# Altium project TAUV-Interfacer.PrjPCB (part 1 of 2)
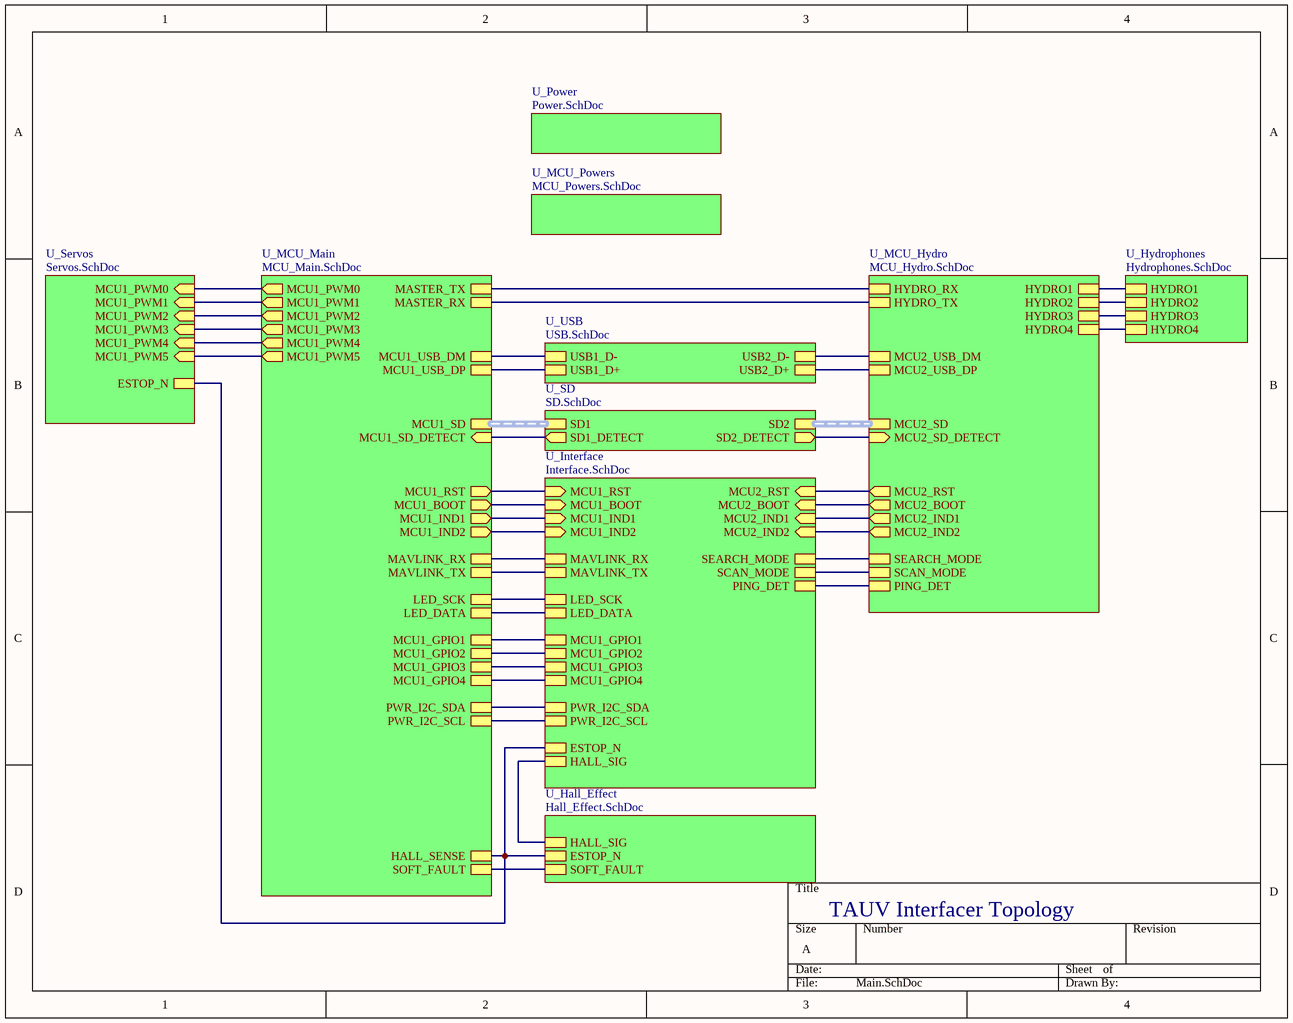
[diagram p0: Main.SchDoc]
12 sheets, 218 parts. Net scope: hierarchical (ports join the sheet entries above them; power ports are global).
Board file: TAUV-Interfacer.PcbDoc
Sheets:
  Main.SchDoc
    U_Hydrophones = Hydrophones.SchDoc
    U_MCU_Hydro = MCU_Hydro.SchDoc
    U_MCU_Main = MCU_Main.SchDoc
    U_SD = SD.SchDoc
    U_USB = USB.SchDoc
    U_MCU_Powers = MCU_Powers.SchDoc
    U_Power = Power.SchDoc
    U_Servos = Servos.SchDoc
    U_Interface = Interface.SchDoc
    U_Hall_Effect = Hall_Effect.SchDoc
  Hydrophone.SchDoc

## Sheet Main.SchDoc
size A; SheetNumber: 1

### Sub-sheets
U_Hall_Effect = Hall_Effect.SchDoc: ESTOP_N, HALL_SIG, SOFT_FAULT
U_Hydrophones = Hydrophones.SchDoc: HYDRO1, HYDRO2, HYDRO3, HYDRO4
U_Interface = Interface.SchDoc: MCU1_BOOT (in), MAVLINK_RX, MAVLINK_TX, LED_SCK, LED_DATA, MCU1_GPIO1, MCU1_GPIO2, MCU1_GPIO3, MCU1_GPIO4, PWR_I2C_SDA, PWR_I2C_SCL, ESTOP_N, HALL_SIG, MCU1_RST (in), MCU1_IND1 (in), MCU1_IND2 (in), MCU2_RST (in), MCU2_BOOT (in), MCU2_IND1 (in), MCU2_IND2 (in), SEARCH_MODE, SCAN_MODE, PING_DET
U_MCU_Hydro = MCU_Hydro.SchDoc: MCU2_BOOT (out), MCU2_USB_DM, MCU2_USB_DP, MCU2_SD (harness SDIO), HYDRO_TX, HYDRO_RX, HYDRO1, HYDRO2, HYDRO3, HYDRO4, MCU2_SD_DETECT (in), MCU2_IND2 (out), SEARCH_MODE, MCU2_IND1 (out), MCU2_RST (out), SCAN_MODE, PING_DET
U_MCU_Main = MCU_Main.SchDoc: MCU1_BOOT (out), MCU1_USB_DM, MCU1_USB_DP, MCU1_SD (harness SDIO), LED_SCK, LED_DATA, MAVLINK_TX, MAVLINK_RX, MASTER_TX, MASTER_RX, MCU1_SD_DETECT (in), MCU1_PWM1 (out), MCU1_PWM2 (out), MCU1_PWM3 (out), MCU1_PWM4 (out), MCU1_PWM5 (out), MCU1_GPIO1, MCU1_GPIO2, MCU1_IND2 (out), MCU1_PWM0 (out), MCU1_IND1 (out), MCU1_GPIO3, MCU1_GPIO4, PWR_I2C_SDA, PWR_I2C_SCL, HALL_SENSE, MCU1_RST (out), SOFT_FAULT
U_MCU_Powers = MCU_Powers.SchDoc: no entries
U_Power = Power.SchDoc: no entries
U_SD = SD.SchDoc: SD1 (harness SDIO), SD1_DETECT (out), SD2 (harness SDIO), SD2_DETECT (out)
U_Servos = Servos.SchDoc: MCU1_PWM1 (in), MCU1_PWM2 (in), MCU1_PWM3 (in), MCU1_PWM4 (in), MCU1_PWM5 (in), MCU1_PWM0 (in), ESTOP_N
U_USB = USB.SchDoc: USB1_D-, USB1_D+, USB2_D-, USB2_D+

### Nets
HALL_SENSE: sheet U_MCU_Main/HALL_SENSE, sheet U_Servos/ESTOP_N, sheet U_Interface/ESTOP_N, sheet U_Hall_Effect/ESTOP_N
IND_PING: sheet U_MCU_Hydro/PING_DET, sheet U_Interface/PING_DET
IND_SCAN: sheet U_MCU_Hydro/SCAN_MODE, sheet U_Interface/SCAN_MODE
IND_SEARCH: sheet U_MCU_Hydro/SEARCH_MODE, sheet U_Interface/SEARCH_MODE
MCU1_BOOT: sheet U_MCU_Main/MCU1_BOOT, sheet U_Interface/MCU1_BOOT
MCU1_GPIO1: sheet U_MCU_Main/MCU1_GPIO1, sheet U_Interface/MCU1_GPIO1
MCU1_GPIO2: sheet U_MCU_Main/MCU1_GPIO2, sheet U_Interface/MCU1_GPIO2
MCU1_GPIO3: sheet U_MCU_Main/MCU1_GPIO3, sheet U_Interface/MCU1_GPIO3
MCU1_GPIO4: sheet U_MCU_Main/MCU1_GPIO4, sheet U_Interface/MCU1_GPIO4
MCU1_I2C_SCL: sheet U_MCU_Main/PWR_I2C_SCL, sheet U_Interface/PWR_I2C_SCL
MCU1_I2C_SDA: sheet U_MCU_Main/PWR_I2C_SDA, sheet U_Interface/PWR_I2C_SDA
MCU1_IND1: sheet U_MCU_Main/MCU1_IND1, sheet U_Interface/MCU1_IND1
MCU1_IND2: sheet U_MCU_Main/MCU1_IND2, sheet U_Interface/MCU1_IND2
MCU1_PWM0: sheet U_MCU_Main/MCU1_PWM0, sheet U_Servos/MCU1_PWM0
MCU1_PWM1: sheet U_MCU_Main/MCU1_PWM1, sheet U_Servos/MCU1_PWM1
MCU1_PWM2: sheet U_MCU_Main/MCU1_PWM2, sheet U_Servos/MCU1_PWM2
MCU1_PWM3: sheet U_MCU_Main/MCU1_PWM3, sheet U_Servos/MCU1_PWM3
MCU1_PWM4: sheet U_MCU_Main/MCU1_PWM4, sheet U_Servos/MCU1_PWM4
MCU1_PWM5: sheet U_MCU_Main/MCU1_PWM5, sheet U_Servos/MCU1_PWM5
MCU1_SD_DETECT: sheet U_MCU_Main/MCU1_SD_DETECT, sheet U_SD/SD1_DETECT
MCU1_SOFT_FAULT: sheet U_MCU_Main/SOFT_FAULT, sheet U_Hall_Effect/SOFT_FAULT
MCU1_SPI1_MOSI: sheet U_MCU_Main/LED_DATA, sheet U_Interface/LED_DATA
MCU1_SPI1_SCK: sheet U_MCU_Main/LED_SCK, sheet U_Interface/LED_SCK
MCU1_UART4_RX: sheet U_MCU_Main/MAVLINK_RX, sheet U_Interface/MAVLINK_RX
MCU1_UART4_TX: sheet U_MCU_Main/MAVLINK_TX, sheet U_Interface/MAVLINK_TX
MCU1_USB_DM: sheet U_MCU_Main/MCU1_USB_DM, sheet U_USB/USB1_D-
MCU1_USB_DP: sheet U_MCU_Main/MCU1_USB_DP, sheet U_USB/USB1_D+
MCU2_ADC1_IN10: sheet U_Hydrophones/HYDRO1, sheet U_MCU_Hydro/HYDRO1
MCU2_ADC1_IN11: sheet U_Hydrophones/HYDRO2, sheet U_MCU_Hydro/HYDRO2
MCU2_ADC1_IN12: sheet U_Hydrophones/HYDRO3, sheet U_MCU_Hydro/HYDRO3
MCU2_ADC1_IN13: sheet U_Hydrophones/HYDRO4, sheet U_MCU_Hydro/HYDRO4
MCU2_BOOT: sheet U_MCU_Hydro/MCU2_BOOT, sheet U_Interface/MCU2_BOOT
MCU2_IND1: sheet U_MCU_Hydro/MCU2_IND1, sheet U_Interface/MCU2_IND1
MCU2_IND2: sheet U_MCU_Hydro/MCU2_IND2, sheet U_Interface/MCU2_IND2
MCU2_SD_DETECT: sheet U_MCU_Hydro/MCU2_SD_DETECT, sheet U_SD/SD2_DETECT
MCU2_USART2_RX: sheet U_MCU_Hydro/HYDRO_RX, sheet U_MCU_Main/MASTER_TX
MCU2_USART2_TX: sheet U_MCU_Hydro/HYDRO_TX, sheet U_MCU_Main/MASTER_RX
MCU2_USB_DM: sheet U_MCU_Hydro/MCU2_USB_DM, sheet U_USB/USB2_D-
MCU2_USB_DP: sheet U_MCU_Hydro/MCU2_USB_DP, sheet U_USB/USB2_D+
NetP2_3: sheet U_MCU_Main/MCU1_RST, sheet U_Interface/MCU1_RST
NetP2_9: sheet U_MCU_Hydro/MCU2_RST, sheet U_Interface/MCU2_RST
NetP3_3: sheet U_Interface/HALL_SIG, sheet U_Hall_Effect/HALL_SIG

### Buses and harness runs
harness sheet U_MCU_Hydro/MCU2_SD = sheet U_SD/SD2
harness sheet U_MCU_Main/MCU1_SD = sheet U_SD/SD1

### Notes on the sheet
- TAUV Interfacer Topology

## Sheet Hydrophones.SchDoc
size 279 x 203 mm; SheetNumber: 7
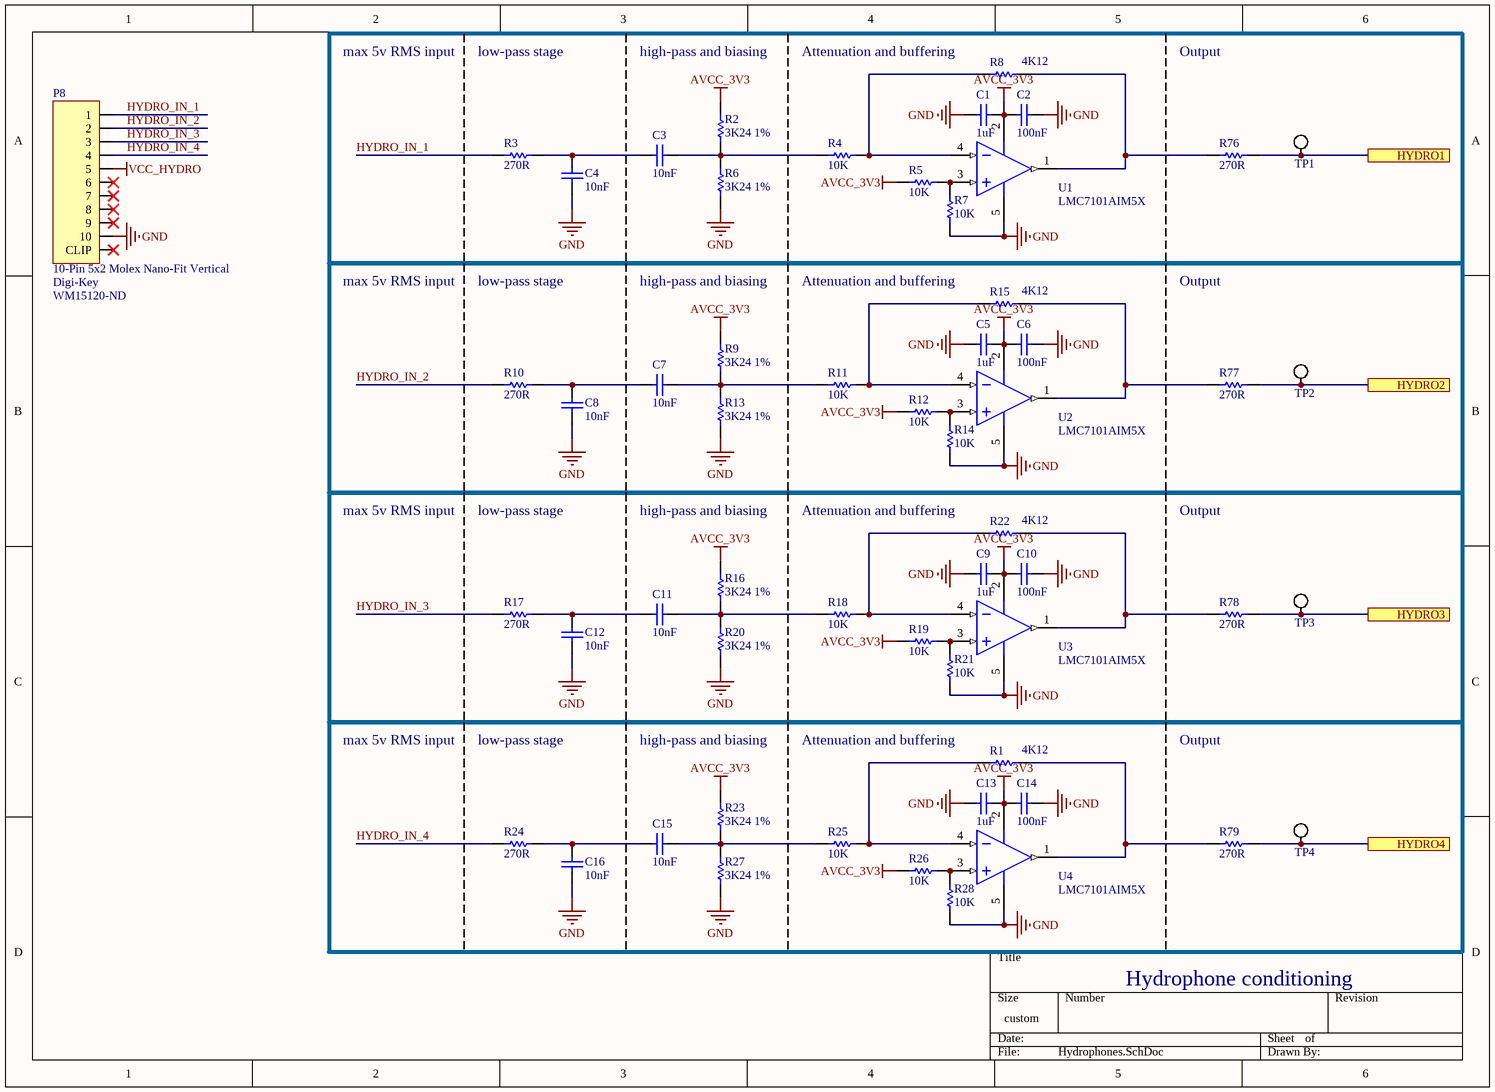
[diagram p1: Hydrophones.SchDoc]

### Parts
(Parts that share a designator on the sheet are numbered #1, #2 ... from top to bottom, then left to right.)
C1#1  1uF  [CAPC0603(1608)100_N]
C2#1  100nF  [CAPC0603(1608)100_N]
C3#1  10nF  [CAPC0603(1608)100_N]
C4#1  10nF  [CAPC0603(1608)100_N]
C5#1  1uF  [CAPC0603(1608)100_N]
C6#1  100nF  [CAPC0603(1608)100_N]
C7#1  10nF  [CAPC0603(1608)100_N]
C8#1  10nF  [CAPC0603(1608)100_N]
C9#1  1uF  [CAPC0603(1608)100_N]
C10  100nF  [CAPC0603(1608)100_N]
C11  10nF  [CAPC0603(1608)100_N]
C12  10nF  [CAPC0603(1608)100_N]
C13  1uF  [CAPC0603(1608)100_N]
C14  100nF  [CAPC0603(1608)100_N]
C15  10nF  [CAPC0603(1608)100_N]
C16  10nF  [CAPC0603(1608)100_N]
P8  10-Pin 5x2 Molex Nano-Fit Vertical  Supplier 1: Digi-Key  Supplier Part Number 1: WM15120-ND  [MOLEX NANO-FIT 2x5 - Vertical]
R1#1  4K12  [RESC0603(1608)_M]
R2#1  3K24 1%  [RESC0603(1608)_N]
R3#1  270R  [RESC0603(1608)_N]
R4#1  10K  [RESC0603(1608)_N]
R5#1  10K  [RESC0603(1608)_N]
R6#1  3K24 1%  [RESC0603(1608)_N]
R7#1  10K  [RESC0603(1608)_N]
R8#1  4K12  [RESC0603(1608)_M]
R9#1  3K24 1%  [RESC0603(1608)_N]
R10#1  270R  [RESC0603(1608)_N]
R11#1  10K  [RESC0603(1608)_N]
R12#1  10K  [RESC0603(1608)_N]
R13#1  3K24 1%  [RESC0603(1608)_N]
R14#1  10K  [RESC0603(1608)_N]
R15#1  4K12  [RESC0603(1608)_M]
R16  3K24 1%  [RESC0603(1608)_N]
R17  270R  [RESC0603(1608)_N]
R18  10K  [RESC0603(1608)_N]
R19  10K  [RESC0603(1608)_N]
R20  3K24 1%  [RESC0603(1608)_N]
R21  10K  [RESC0603(1608)_N]
R22  4K12  [RESC0603(1608)_M]
R23  3K24 1%  [RESC0603(1608)_N]
R24  270R  [RESC0603(1608)_N]
R25  10K  [RESC0603(1608)_N]
R26  10K  [RESC0603(1608)_N]
R27  3K24 1%  [RESC0603(1608)_N]
R28  10K  [RESC0603(1608)_N]
R76  270R  [RESC0603(1608)_N]
R77  270R  [RESC0603(1608)_N]
R78  270R  [RESC0603(1608)_N]
R79  270R  [RESC0603(1608)_N]
TP1#1  Test Point Loop  [Test Point Loop - Black]  (value not drawn)
TP2  Test Point Loop  [Test Point Loop - Black]  (value not drawn)
TP3  Test Point Loop  [Test Point Loop - Black]  (value not drawn)
TP4  Test Point Loop  [Test Point Loop - Black]  (value not drawn)
U1#1  LMC7101AIM5X  [DBV0005A_N]
U2#1  LMC7101AIM5X  [DBV0005A_N]
U3#1  LMC7101AIM5X  [DBV0005A_N]
U4  LMC7101AIM5X  [DBV0005A_N]

### Ports
HYDRO1, HYDRO2, HYDRO3, HYDRO4

### Nets
AVCC_3V3: C1#1.1 C2#1.2 C5#1.1 C6#1.2 C9#1.1 C10.2 C13.1 C14.2 R2#1.2 R5#1.1 R9#1.2 R12#1.1 R16.2 R19.1 R23.2 R26.1 U1#1.2(V+) U2#1.2(V+) U3#1.2(V+) U4.2(V+)
GND: C1#1.2 C2#1.1 C4#1.1 C5#1.2 C6#1.1 C8#1.1 C9#1.2 C10.1 C12.1 C13.2 C14.1 C16.1 P8.10 R6#1.1 R7#1.1 R13#1.1 R14#1.1 R20.1 R21.1 R27.1 R28.1 U1#1.5(V-) U2#1.5(V-) U3#1.5(V-) U4.5(V-)
VCC_HYDRO: P8.5
HYDRO_IN_1: P8.1 R3#1.1
HYDRO_IN_2: P8.2 R10#1.1
HYDRO_IN_3: P8.3 R17.1
HYDRO_IN_4: P8.4 R24.1
MCU2_ADC1_IN10: R76.2 TP1#1.1 ; port HYDRO1
MCU2_ADC1_IN11: R77.2 TP2.1 ; port HYDRO2
MCU2_ADC1_IN12: R78.2 TP3.1 ; port HYDRO3
MCU2_ADC1_IN13: R79.2 TP4.1 ; port HYDRO4
NetC3#1_1: C3#1.1 C4#1.2 R3#1.2
NetC3#1_2: C3#1.2 R2#1.1 R4#1.1 R6#1.2
NetC7#1_1: C7#1.1 C8#1.2 R10#1.2
NetC7#1_2: C7#1.2 R9#1.1 R11#1.1 R13#1.2
NetC11_1: C11.1 C12.2 R17.2
NetC11_2: C11.2 R16.1 R18.1 R20.2
NetC15_1: C15.1 C16.2 R24.2
NetC15_2: C15.2 R23.1 R25.1 R27.2
NetR1#1_1: R1#1.1 R25.2 U4.4(IN-)
NetR1#1_2: R1#1.2 R79.1 U4.1(OUT)
NetR4#1_2: R4#1.2 R8#1.1 U1#1.4(IN-)
NetR5#1_2: R5#1.2 R7#1.2 U1#1.3(IN+)
NetR8#1_2: R8#1.2 R76.1 U1#1.1(OUT)
NetR11#1_2: R11#1.2 R15#1.1 U2#1.4(IN-)
NetR12#1_2: R12#1.2 R14#1.2 U2#1.3(IN+)
NetR15#1_2: R15#1.2 R77.1 U2#1.1(OUT)
NetR18_2: R18.2 R22.1 U3#1.4(IN-)
NetR19_2: R19.2 R21.2 U3#1.3(IN+)
NetR22_2: R22.2 R78.1 U3#1.1(OUT)
NetR26_2: R26.2 R28.2 U4.3(IN+)

Not connected (* = marked no-connect by the designer): P8 6* 7* 8* 9* 11(CLIP)*

### Notes on the sheet
- max 5v RMS input
- low-pass stage
- high-pass and biasing
- (near R8#1) Attenuation and buffering
- Output
- (near R15#1) Attenuation and buffering
- (near R22) Attenuation and buffering
- (near R1#1) Attenuation and buffering
- Hydrophone conditioning

### Library data of the parts
C1#1 C5#1 C9#1 C13 = CMP-1035-02733-1: CAP 1uF 10V ±10% 0603 (1608 Metric) Thickness 1mm SMD; Tolerance: Â±10%; Case-EIA: 0603; Case-Metric: 1608; Rated Voltage: 10 V; Max Thickness: 1 mm; Value: 1uF; Technology: SMT
C2#1 C6#1 C10 C14 = CMP-1035-02580-1: CAP 100nF 10V ±10% 0603 (1608 Metric) Thickness 1mm SMD; Tolerance: Â±10%; Case-EIA: 0603; Case-Metric: 1608; Max Thickness: 1 mm; Value: 100nF; Rated Voltage: 10 V; Technology: SMT
C3#1 C4#1 C7#1 C8#1 C11 C12 C15 C16 = CMP-1035-02314-1: CAP 10nF 25V ±1% 0603 (1608 Metric) Thickness 1mm SMD; Case-EIA: 0603; Tolerance: Â±1%; Case-Metric: 1608; Technology: SMT; Value: 10nF; Rated Voltage: 25 V; Max Thickness: 1 mm
P8 = 10-Pin 2-Row Nano-Fit_Vertical: NanoFit VT Hdr TH DR 10Ckt; Part Number: 105314-1216; Supplier: Digi-Key; Manufacturer: Molex; Supplier Part Number: WM15165-ND; ComponentLink1Description: Digikey Link; ComponentLink1URL: https://www.digikey.com/product-detail/en/molex-llc/1053121310/WM15120-ND/6164209
R1#1 R8#1 R15#1 R22 = CMP-1012-00579-1: 4K12 0.1W 1% 0603 (1608 Metric)  SMD; Case-EIA: 0603; Value: 4120.00 Ohm; Case-Metric: 1608; Technology: SMT; Tolerance: 1 %; Power: 0.1 W
R2#1 R6#1 R9#1 R13#1 R16 R20 R23 R27 = CMP-1012-00566-1: 3K24 0.1W 1% 0603 (1608 Metric)  SMD; Value: 3240.00 Ohm; Case-Metric: 1608; Case-EIA: 0603; Tolerance: 1 %; Technology: SMT; Power: 0.1 W
R3#1 R10#1 R17 R24 R76-R79 = CMP-1012-00444-1: 270R 0.1W 1% 0603 (1608 Metric)  SMD; Value: 270.00 Ohm; Case-EIA: 0603; Case-Metric: 1608; Technology: SMT; Power: 0.1 W; Tolerance: 1 %
R4#1 R5#1 R7#1 R11#1 R12#1 R14#1 R18 R19 R21 R25 R26 R28 = CMP-1012-00623-1: 10K 0.1W 1% 0603 (1608 Metric)  SMD; Value: 10000.00 Ohm; Case-EIA: 0603; Case-Metric: 1608; Power: 0.1 W; Tolerance: 1 %; Technology: SMT
TP1#1 TP2-TP4 = Test Point Loop: Keyston Electronics 5001 Test Point Loop; Manufacturer P/N: 5001; Manufacturer: Keystone Electronics; Color: Black; Supplier 1: Digi-Key; Supplier Part Number 1: 36-5001-ND
U1#1 U2#1 U3#1 U4 = CMP-0055-01331-3: Tiny Low Power Operational Amplifier with Rail-to-Rail Input and Output, 5-pin SOT-23; Manufacturer: Texas Instruments; CompType: Amplifiers; PowerWise: N; PackageTopMarking: A00A*XTT; Package Reference: DBV0005A; ComponentLink1URL: http://www.ti.com/general/docs/lit/getliterature.tsp?genericPartNumber=LMC7101&fileType=pdf; ComponentLink1Description: Datasheet URL; RoHS: N; PackageDescription: Molded SOT-23, .115 x .063 x .040 in Body, 5 Lead, .0375 in Pitch; PinCount: 5

## Sheet MCU_Hydro.SchDoc
size A4; SheetNumber: 6
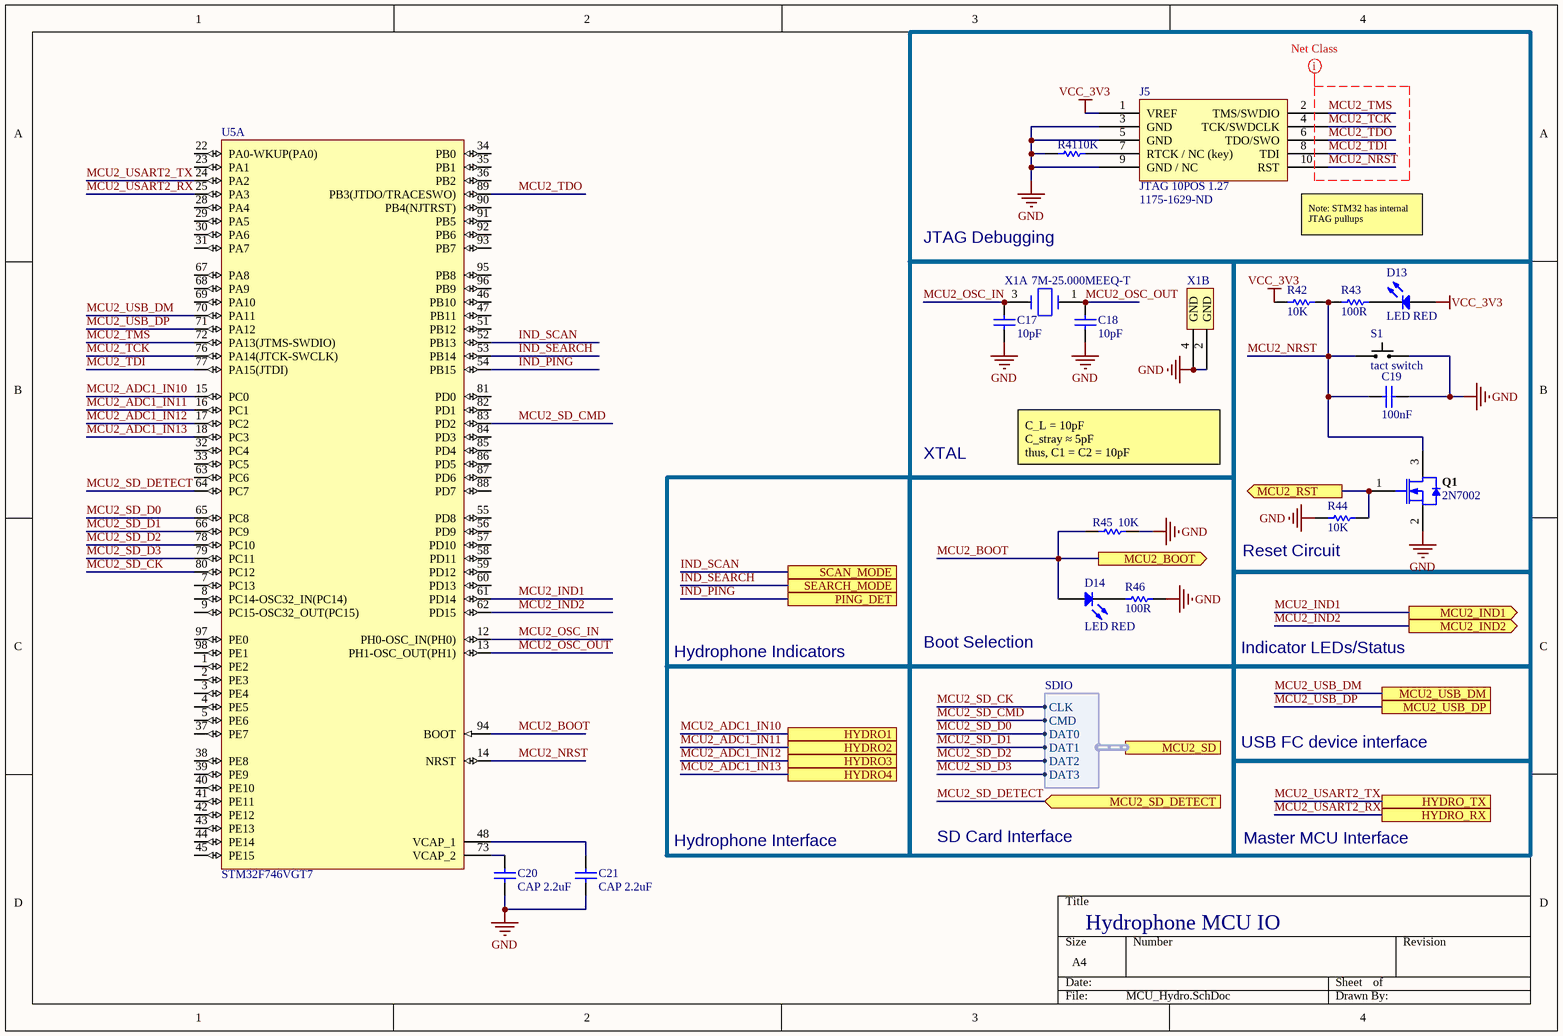
[diagram p2: MCU_Hydro.SchDoc]

### Parts
C17  10pF  [CAPC0603(1608)100_N]
C18  10pF  [CAPC0603(1608)100_N]
C19  100nF  [CAPC0603(1608)100_N]
C20  CAP 2.2uF  [CAPC0603(1608)100_N]
C21  CAP 2.2uF  [CAPC0603(1608)100_N]
D13  LED RED  [LED_0805]
D14  LED RED  [LED_0805]
J5  JTAG 10POS 1.27  Supplier Part Number 1: 1175-1629-ND  [5x2 JTAG SMD]
Q1  2N7002  [INF-PG-SOT23_M]
R41  10K  [RESC0603(1608)_N]
R42  10K  [RESC0603(1608)_N]
R43  100R  [RESC0603(1608)_N]
R44  10K  [RESC0603(1608)_N]
R45  10K  [RESC0603(1608)_N]
R46  100R  [RESC0603(1608)_N]
S1  tact switch  [EVP-AA202K]
U5  STM32F746VGT7  [STM-LQFP100_L]  (part A of 2)
X1  7M-25.000MEEQ-T  [OSCSC320X250X100N]  (parts A,B of 2)

### Blocks framed on the sheet
JTAG Debugging: J5 R41
Reset Circuit: C19 D13 Q1 R42-R44 S1

### Ports
HYDRO1, HYDRO2, HYDRO3, HYDRO4, HYDRO_RX, HYDRO_TX, MCU2_BOOT (out), MCU2_IND1 (out), MCU2_IND2 (out), MCU2_RST (out), MCU2_SD (harness SDIO), MCU2_SD_DETECT (in), MCU2_USB_DM, MCU2_USB_DP, PING_DET, SCAN_MODE, SEARCH_MODE

### Harnesses
SDIO: CLK, CMD, DAT0, DAT1, DAT2, DAT3

### Nets
GND: C17.1 C18.1 C19.1 C20.1 C21.1 J5.3(GND) J5.5(GND) J5.9(GND_/_NC) Q1.2(SOURCE) R41.1 R44.2 R45.2 R46.2 S1.2 X1.2(GND) X1.4(GND)
VCC_3V3: D13.2(A) J5.1(VREF) R42.2
IND_PING: U5.54(PB15) ; port PING_DET
IND_SCAN: U5.52(PB13) ; port SCAN_MODE
IND_SEARCH: U5.53(PB14) ; port SEARCH_MODE
MCU2_ADC1_IN10: U5.15(PC0) ; port HYDRO1
MCU2_ADC1_IN11: U5.16(PC1) ; port HYDRO2
MCU2_ADC1_IN12: U5.17(PC2) ; port HYDRO3
MCU2_ADC1_IN13: U5.18(PC3) ; port HYDRO4
MCU2_BOOT: D14.2(A) R45.1 U5.94(BOOT) ; port MCU2_BOOT
MCU2_IND1: U5.61(PD14) ; port MCU2_IND1
MCU2_IND2: U5.62(PD15) ; port MCU2_IND2
MCU2_NRST: C19.2 J5.10(RST) Q1.3(DRAIN) R42.1 R43.2 S1.1 U5.14(NRST)
MCU2_OSC_IN: C17.2 U5.12(PH0-OSC_IN(PH0)) X1.3
MCU2_OSC_OUT: C18.2 U5.13(PH1-OSC_OUT(PH1)) X1.1
MCU2_SD_CK: U5.80(PC12) ; port MCU2_SD.CLK
MCU2_SD_CMD: U5.83(PD2) ; port MCU2_SD.CMD
MCU2_SD_D0: U5.65(PC8) ; port MCU2_SD.DAT0
MCU2_SD_D1: U5.66(PC9) ; port MCU2_SD.DAT1
MCU2_SD_D2: U5.78(PC10) ; port MCU2_SD.DAT2
MCU2_SD_D3: U5.79(PC11) ; port MCU2_SD.DAT3
MCU2_SD_DETECT: U5.64(PC7) ; port MCU2_SD_DETECT
MCU2_TCK: J5.4(TCK/SWDCLK) U5.76(PA14(JTCK-SWCLK))
MCU2_TDI: J5.8(TDI) U5.77(PA15(JTDI))
MCU2_TDO: J5.6(TDO/SWO) U5.89(PB3(JTDO/TRACESWO))
MCU2_TMS: J5.2(TMS/SWDIO) U5.72(PA13(JTMS-SWDIO))
MCU2_USART2_RX: U5.25(PA3) ; port HYDRO_RX
MCU2_USART2_TX: U5.24(PA2) ; port HYDRO_TX
MCU2_USB_DM: U5.70(PA11) ; port MCU2_USB_DM
MCU2_USB_DP: U5.71(PA12) ; port MCU2_USB_DP
NetC20_2: C20.2 U5.73(VCAP_2)
NetC21_2: C21.2 U5.48(VCAP_1)
NetD13_1: D13.1(K) R43.1
NetD14_1: D14.1(K) R46.1
NetJ5_7: J5.7(RTCK_/_NC_(key)) R41.2
NetP2_9: Q1.1(GATE) R44.1 ; port MCU2_RST

Not connected (* = marked no-connect by the designer): U5 1(PE2) 2(PE3) 3(PE4) 4(PE5) 5(PE6) 7(PC13) 8(PC14-OSC32_IN(PC14)) 9(PC15-OSC32_OUT(PC15)) 22(PA0-WKUP(PA0)) 23(PA1) 28(PA4) 29(PA5) 30(PA6) 31(PA7) 32(PC4) 33(PC5) 34(PB0) 35(PB1) 36(PB2) 37(PE7) 38(PE8) 39(PE9) 40(PE10) 41(PE11) 42(PE12) 43(PE13) 44(PE14) 45(PE15) 46(PB10) 47(PB11) 51(PB12) 55(PD8) 56(PD9) 57(PD10) 58(PD11) 59(PD12) 60(PD13) 63(PC6) 67(PA8) 68(PA9) 69(PA10) 81(PD0) 82(PD1) 84(PD3) 85(PD4) 86(PD5) 87(PD6) 88(PD7) 90(PB4(NJTRST)) 91(PB5) 92(PB6) 93(PB7) 95(PB8) 96(PB9) 97(PE0) 98(PE1)

### Layout directives
net class JTAG: MCU2_NRST, MCU2_TCK, MCU2_TDI, MCU2_TDO, MCU2_TMS

### Notes on the sheet
- (near J5) Note: STM32 has internal JTAG pullups
- XTAL
- C_L = 10pF
  C_stray ≈ 5pF
  thus, C1 = C2 = 10pF
- Boot Selection
- Indicator LEDs/Status
- Hydrophone Indicators
- USB FC device interface
- Hydrophone Interface
- SD Card Interface
- Master MCU Interface
- Hydrophone MCU IO

### Library data of the parts
C17 C18 = CMP-1035-00549-1: CAP 10pF 25V ±1% 0603 (1608 Metric) Thickness 1mm SMD; Case-EIA: 0603; Case-Metric: 1608; Tolerance: Â±1%; Technology: SMT; Max Thickness: 1 mm; Value: 10pF; Rated Voltage: 25 V
C19 = CMP-1035-02580-1: as C2#1 on sheet Hydrophones; Max Thickness: 1 mm; Value: 100nF; Rated Voltage: 10 V; Technology: SMT
C20 C21 = CMP-1035-02758-1: CAP 2.2uF 10V ±10% 0603 (1608 Metric) Thickness 1mm SMD; Case-EIA: 0603; Case-Metric: 1608; Tolerance: Â±10%; Rated Voltage: 10 V; Value: 2.2uF; Max Thickness: 1 mm; Technology: SMT
D13 D14 = LED0: led; Manufacturer: Lite-On Inc.; Manufacturer Part Number: LTST-C171KRKT; Lens Color: Colorless; Lens Transparency: Clear; Millicandela Rating: 54mcd; Lens Style/Size: Rectangle with Flat Top, 1.40mm x 1.25mm; Voltage - Forward (Vf) (Typ): 2V; Current - Test: 20mA; Viewing Angle: 130°; Wavelength - Dominant: 631nm; Wavelength - Peak: 639nm; Supplier 1: Digi-Key; Supplier Part Number 1: 160-1427-1-ND; RoHS: RoHS Compliant; Category: Optoelectronics; Stock 1: 260544; Pricing 1: 1=0.31, 10=0.225, 25=0.1656, 100=0.1183, 250=0.0804, 500=0.07096, 1000=0.05558 (USD); Packaging: Cut Tape (CT); Part Status: Active; Color: Red; Mounting Type: Surface Mount; Features: -; Package / Case: 0805 (2012 Metric); Size / Dimension: 2.00mm L x 1.25mm W; Height (Max): 0.80mm; ComponentLink1URL: http://optoelectronics.liteon.com/upload/download/DS22-2000-109/LTST-C171KRKT.pdf; ComponentLink1Description: http://optoelectronics.liteon.com/upload/download/DS22-2000-109/LTST-C171KRKT.pdf
J5 = jtag 10pos mini: Supplier 1: Digi-Key
Q1 = CMP-1149-00026-1: N-Channel OptiMOS Small-Signal-Transistor, 60 V VDS, 0.3 A ID, -55 to 150 degC, PG-SOT23, Reel, Green; Manufacturer: Infineon; RDS (on) (max) (@4.5V): 4,000 mOhm; VDS (max): 60 V; IDpuls (max): 1.2Â A; QG: 0.4Â nC; RDS (on) (max): 3,000 mOhm; RthJA (max): 250 K/W; ID (max): 0.3Â A; VGS(th) (max): 2.5Â V; VGS(th) (min): 1.5Â V; Green: TRUE; Ptot (max): 0.5Â W; PackageDescription: 3-Pin Small Outline Transistor Package, 2.9 x 1.3 mm Body, 0.95 mm Pitch; Halogen-free: TRUE; ComponentLink2Description: Datasheet; ComponentLink1URL: http://www.infineon.com/; Packing: Reel; DatasheetVersion: Rev. 2.4; PartNumber: 2N7002; PackageReference: PG-SOT23; PackageVersion: Apr-08; ComponentLink3URL: http://www.infineon.com/dgdl/SOT23-Package_Overview.pdf?folderId=db3a30431936bc4b0119532290053c66&fileId=db3a30431936bc4b0119533468123c85; ComponentLink1Description: Manufacturer URL; Mounting Technology: Surface Mount; ComponentLink3Description: Package Specification; ComponentLink2URL: http://www.infineon.com/dgdl/2N7002_Rev2.4.pdf?folderId=db3a3043156fd573011622e10b5c1f67&fileId=db3a304319bc939a0119c2a9461e79e6
R41 R42 R44 R45 = CMP-1012-00098-1: 10K 0.1W 5% 0603 (1608 Metric)  SMD; Case-EIA: 0603; Value: 10000.00 Ohm; Case-Metric: 1608; Technology: SMT; Tolerance: 5 %; Power: 0.1 W
R43 R46 = CMP-1012-00050-1: 100R 0.1W 5% 0603 (1608 Metric)  SMD; Case-EIA: 0603; Value: 100.00 Ohm; Case-Metric: 1608; Tolerance: 5 %; Technology: SMT; Power: 0.1 W
S1 = EVP-AA Switch: EVP-AA Momentary Switch SPST-NO; Part Number: EVP-AA202K; Supplier 1: Digi-Key; Supplier Part Number 1: P13348SCT-ND; Datasheet: http://industrial.panasonic.com/lecs/www-data/pdf/ATK0000/ATK0000CE26.pdf
U5 = CMP-1572-00044-1: ARM Cortex-M4 32-bit MCU+FPU, 1024 KB Flash, 320 KB Internal RAM, 82 I/Os, 100-Pin LQFP, -40 to 105 degC, Tray; FLASH Size (Prog) (kB): 1024; Internal RAM Size (kB): 320; I/Os (High Current): 82; Core: ARM Cortex-M7; Operating Frequency(F) (Processor speed) (MHz): 216; D/A Converter: 2; Supply Voltage(Vcc) min (V): 1.7; ComponentLink2Description: Datasheet; Package Reference: LQFP100; ComponentLink1URL: http://www.st.com/; Mounting Technology: Surface Mount; DatasheetVersion: Rev. 2; Package Description: 100-Pin Low Profile Quad Flat Package, Body 14 x 14 mm, Pitch 0.5 mm; ComponentLink1Description: Manufacturer URL; ComponentLink2URL: http://www.st.com/st-web-ui/static/active/en/resource/technical/document/datasheet/DM00166116.pdf; Packing: Tray
X1 = 7M-25.000MEEQ-T: CRYSTAL 25.0000MHZ 10PF SMD; Manufacturer 1: TXC; Frequency: 25MHz; Frequency Tolerance: 10ppm; ESR (Equivalent Series Resistance): 60R; Supplier 1: Digi-Key; Supplier Part Number 1: 887-1326-1-ND; Manufacturer Part Number 1: 7M-25.000MEEQ-T; Stock 1: 17097; Pricing 1: 1=1.27, 10=1.209, 50=1.1812, 100=1.0125, 500=0.9844, 1000=0.8297 (USD); Mount: Surface Mount; Case/Package: SMD/SMT; Number of Pins: 4; Min Operating Temperature: -20°C; Max Operating Temperature: 70°C; Load Capacitance: 10pF; Packaging: Tape and Reel; Package Quantity: 3000; Tolerance: 10ppm; Frequency Stability: 10ppm; Termination: SMD/SMT; Length: 3.2mm; Height: 0.031inch; Width: 0.098inch; Depth: 2.5mm; REACH SVHC: No SVHC; ComponentLink1URL: https://datasheet.ciiva.com/26918/getdatasheetpartid-757227-26918816.pdf; ComponentLink1Description: https://datasheet.ciiva.com/26918/getdatasheetpartid-757227-26918816.pdf; ComponentLink2URL: https://datasheet.ciiva.com/856/7m-accuracy-856022.pdf; ComponentLink2Description: https://datasheet.ciiva.com/856/7m-accuracy-856022.pdf; ComponentLink3URL: https://datasheet.ciiva.com/22658/1794111-22658486.pdf; ComponentLink3Description: https://datasheet.ciiva.com/22658/1794111-22658486.pdf; ComponentLink4URL: https://datasheet.ciiva.com/856/7m-accuracy-856023.pdf; ComponentLink4Description: https://datasheet.ciiva.com/856/7m-accuracy-856023.pdf; ComponentLink5URL: https://datasheet.ciiva.com/856/7m-accuracy-856024.pdf; ComponentLink5Description: https://datasheet.ciiva.com/856/7m-accuracy-856024.pdf; ComponentLink6URL: https://datasheet.ciiva.com/4946/7m-11184-4946126.pdf; ComponentLink6Description: https://datasheet.ciiva.com/4946/7m-11184-4946126.pdf; ComponentLink7URL: https://datasheet.ciiva.com/28498/1794111-28498878.pdf; ComponentLink7Description: https://datasheet.ciiva.com/28498/1794111-28498878.pdf

## Sheet MCU_Main.SchDoc
size A4; SheetNumber: 5
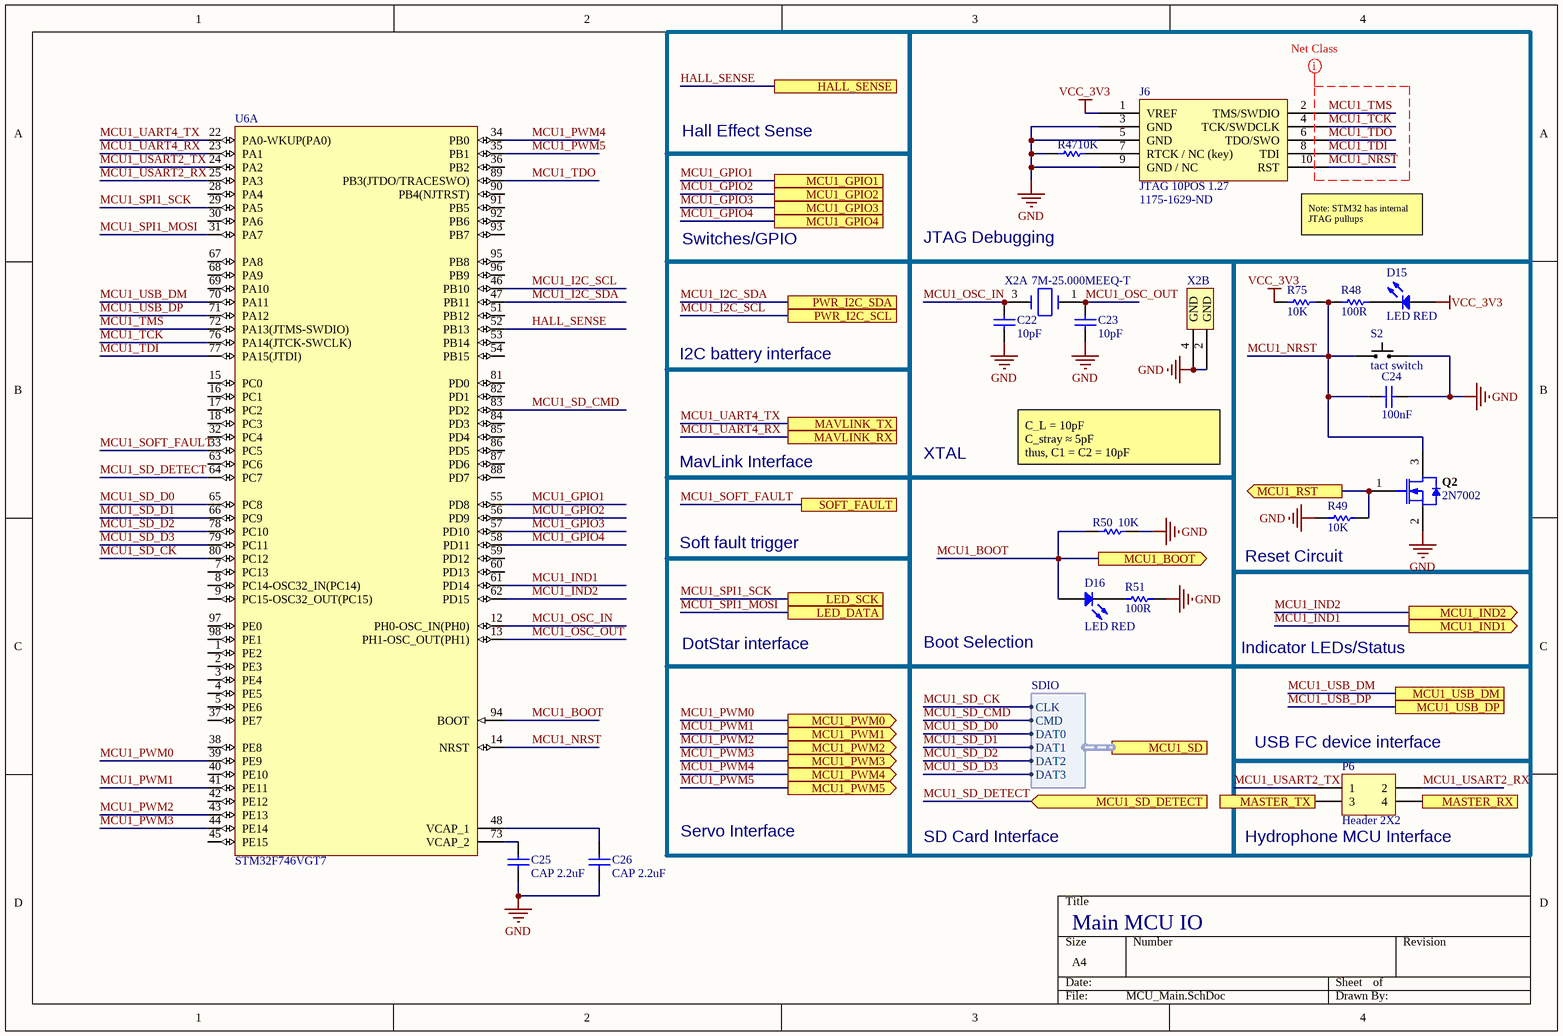
[diagram p3: MCU_Main.SchDoc]

### Parts
C22  10pF  [CAPC0603(1608)100_N]
C23  10pF  [CAPC0603(1608)100_N]
C24  100nF  [CAPC0603(1608)100_N]
C25  CAP 2.2uF  [CAPC0603(1608)100_N]
C26  CAP 2.2uF  [CAPC0603(1608)100_N]
D15  LED RED  [LED_0805]
D16  LED RED  [LED_0805]
J6  JTAG 10POS 1.27  Supplier Part Number 1: 1175-1629-ND  [5x2 JTAG SMD]
P6  Header 2X2  [HDR2X2]
Q2  2N7002  [INF-PG-SOT23_M]
R47  10K  [RESC0603(1608)_N]
R48  100R  [RESC0603(1608)_N]
R49  10K  [RESC0603(1608)_N]
R50  10K  [RESC0603(1608)_N]
R51  100R  [RESC0603(1608)_N]
R75  10K  [RESC0603(1608)_N]
S2  tact switch  [EVP-AA202K]
U6  STM32F746VGT7  [STM-LQFP100_L]  (part A of 2)
X2  7M-25.000MEEQ-T  [OSCSC320X250X100N]  (parts A,B of 2)

### Blocks framed on the sheet
JTAG Debugging: J6 R47
Reset Circuit: C24 D15 Q2 R48 R49 R75 S2

### Ports
HALL_SENSE, LED_DATA, LED_SCK, MASTER_RX, MASTER_TX, MAVLINK_RX, MAVLINK_TX, MCU1_BOOT (out), MCU1_GPIO1, MCU1_GPIO2, MCU1_GPIO3, MCU1_GPIO4, MCU1_IND1 (out), MCU1_IND2 (out), MCU1_PWM0 (out), MCU1_PWM1 (out), MCU1_PWM2 (out), MCU1_PWM3 (out), MCU1_PWM4 (out), MCU1_PWM5 (out), MCU1_RST (out), MCU1_SD (harness SDIO), MCU1_SD_DETECT (in), MCU1_USB_DM, MCU1_USB_DP, PWR_I2C_SCL, PWR_I2C_SDA, SOFT_FAULT

### Harnesses
SDIO: CLK, CMD, DAT0, DAT1, DAT2, DAT3

### Nets
GND: C22.1 C23.1 C24.1 C25.1 C26.1 J6.3(GND) J6.5(GND) J6.9(GND_/_NC) Q2.2(SOURCE) R47.1 R49.2 R50.2 R51.2 S2.2 X2.2(GND) X2.4(GND)
VCC_3V3: D15.2(A) J6.1(VREF) R75.2
HALL_SENSE: U6.52(PB13) ; port HALL_SENSE
MCU1_BOOT: D16.2(A) R50.1 U6.94(BOOT) ; port MCU1_BOOT
MCU1_GPIO1: U6.55(PD8) ; port MCU1_GPIO1
MCU1_GPIO2: U6.56(PD9) ; port MCU1_GPIO2
MCU1_GPIO3: U6.57(PD10) ; port MCU1_GPIO3
MCU1_GPIO4: U6.58(PD11) ; port MCU1_GPIO4
MCU1_I2C_SCL: U6.46(PB10) ; port PWR_I2C_SCL
MCU1_I2C_SDA: U6.47(PB11) ; port PWR_I2C_SDA
MCU1_IND1: U6.61(PD14) ; port MCU1_IND1
MCU1_IND2: U6.62(PD15) ; port MCU1_IND2
MCU1_NRST: C24.2 J6.10(RST) Q2.3(DRAIN) R48.2 R75.1 S2.1 U6.14(NRST)
MCU1_OSC_IN: C22.2 U6.12(PH0-OSC_IN(PH0)) X2.3
MCU1_OSC_OUT: C23.2 U6.13(PH1-OSC_OUT(PH1)) X2.1
MCU1_PWM0: U6.39(PE9) ; port MCU1_PWM0
MCU1_PWM1: U6.41(PE11) ; port MCU1_PWM1
MCU1_PWM2: U6.43(PE13) ; port MCU1_PWM2
MCU1_PWM3: U6.44(PE14) ; port MCU1_PWM3
MCU1_PWM4: U6.34(PB0) ; port MCU1_PWM4
MCU1_PWM5: U6.35(PB1) ; port MCU1_PWM5
MCU1_SD_CK: U6.80(PC12) ; port MCU1_SD.CLK
MCU1_SD_CMD: U6.83(PD2) ; port MCU1_SD.CMD
MCU1_SD_D0: U6.65(PC8) ; port MCU1_SD.DAT0
MCU1_SD_D1: U6.66(PC9) ; port MCU1_SD.DAT1
MCU1_SD_D2: U6.78(PC10) ; port MCU1_SD.DAT2
MCU1_SD_D3: U6.79(PC11) ; port MCU1_SD.DAT3
MCU1_SD_DETECT: U6.64(PC7) ; port MCU1_SD_DETECT
MCU1_SOFT_FAULT: U6.33(PC5) ; port SOFT_FAULT
MCU1_SPI1_MOSI: U6.31(PA7) ; port LED_DATA
MCU1_SPI1_SCK: U6.29(PA5) ; port LED_SCK
MCU1_TCK: J6.4(TCK/SWDCLK) U6.76(PA14(JTCK-SWCLK))
MCU1_TDI: J6.8(TDI) U6.77(PA15(JTDI))
MCU1_TDO: J6.6(TDO/SWO) U6.89(PB3(JTDO/TRACESWO))
MCU1_TMS: J6.2(TMS/SWDIO) U6.72(PA13(JTMS-SWDIO))
MCU1_UART4_RX: U6.23(PA1) ; port MAVLINK_RX
MCU1_UART4_TX: U6.22(PA0-WKUP(PA0)) ; port MAVLINK_TX
MCU1_USART2_RX: P6.2 U6.25(PA3)
MCU1_USART2_TX: P6.1 U6.24(PA2)
MCU1_USB_DM: U6.70(PA11) ; port MCU1_USB_DM
MCU1_USB_DP: U6.71(PA12) ; port MCU1_USB_DP
MCU2_USART2_RX: P6.3 ; port MASTER_TX
MCU2_USART2_TX: P6.4 ; port MASTER_RX
NetC25_2: C25.2 U6.73(VCAP_2)
NetC26_2: C26.2 U6.48(VCAP_1)
NetD15_1: D15.1(K) R48.1
NetD16_1: D16.1(K) R51.1
NetJ6_7: J6.7(RTCK_/_NC_(key)) R47.2
NetP2_3: Q2.1(GATE) R49.1 ; port MCU1_RST

Not connected (* = marked no-connect by the designer): U6 1(PE2) 2(PE3) 3(PE4) 4(PE5) 5(PE6) 7(PC13) 8(PC14-OSC32_IN(PC14)) 9(PC15-OSC32_OUT(PC15)) 15(PC0) 16(PC1) 17(PC2) 18(PC3) 28(PA4) 30(PA6) 32(PC4) 36(PB2) 37(PE7) 38(PE8) 40(PE10) 42(PE12) 45(PE15) 51(PB12) 53(PB14) 54(PB15) 59(PD12) 60(PD13) 63(PC6) 67(PA8) 68(PA9) 69(PA10) 81(PD0) 82(PD1) 84(PD3) 85(PD4) 86(PD5) 87(PD6) 88(PD7) 90(PB4(NJTRST)) 91(PB5) 92(PB6) 93(PB7) 95(PB8) 96(PB9) 97(PE0) 98(PE1)

### Layout directives
net class JTAG: MCU1_NRST, MCU1_TCK, MCU1_TDI, MCU1_TDO, MCU1_TMS

### Notes on the sheet
- Hall Effect Sense
- Switches/GPIO
- (near J6) Note: STM32 has internal JTAG pullups
- I2C battery interface
- MavLink Interface
- XTAL
- C_L = 10pF
  C_stray ≈ 5pF
  thus, C1 = C2 = 10pF
- Soft fault trigger
- DotStar interface
- Boot Selection
- Indicator LEDs/Status
- (near P6) USB FC device interface
- Servo Interface
- SD Card Interface
- (near P6) Hydrophone MCU Interface
- Main MCU IO

### Library data of the parts
C22 C23 = CMP-1035-00549-1: as C17 on sheet MCU_Hydro; Technology: SMT; Max Thickness: 1 mm; Value: 10pF; Rated Voltage: 25 V
C24 = CMP-1035-02580-1: as C2#1 on sheet Hydrophones; Max Thickness: 1 mm; Value: 100nF; Rated Voltage: 10 V; Technology: SMT
C25 C26 = CMP-1035-02758-1: as C20 on sheet MCU_Hydro; Rated Voltage: 10 V; Value: 2.2uF; Max Thickness: 1 mm; Technology: SMT
D15 D16 = LED0: as D13 on sheet MCU_Hydro; Supplier 1: Digi-Key; Supplier Part Number 1: 160-1427-1-ND; RoHS: RoHS Compliant; Category: Optoelectronics; Stock 1: 260544; Pricing 1: 1=0.31, 10=0.225, 25=0.1656, 100=0.1183, 250=0.0804, 500=0.07096, 1000=0.05558 (USD); Packaging: Cut Tape (CT); Part Status: Active; Color: Red; Mounting Type: Surface Mount; Features: -; Package / Case: 0805 (2012 Metric); Size / Dimension: 2.00mm L x 1.25mm W; Height (Max): 0.80mm; ComponentLink1URL: http://optoelectronics.liteon.com/upload/download/DS22-2000-109/LTST-C171KRKT.pdf; ComponentLink1Description: http://optoelectronics.liteon.com/upload/download/DS22-2000-109/LTST-C171KRKT.pdf
J6 = jtag 10pos mini: Supplier 1: Digi-Key
P6 = Header 2X2: Header, 2-Pin, Dual row; LatestRevisionDate: 17-Jul-2002; LatestRevisionNote: Re-released for DXP Platform.; Publisher: Altium Limited
Q2 = CMP-1149-00026-1: as Q1 on sheet MCU_Hydro; PackageDescription: 3-Pin Small Outline Transistor Package, 2.9 x 1.3 mm Body, 0.95 mm Pitch; Halogen-free: TRUE; ComponentLink2Description: Datasheet; ComponentLink1URL: http://www.infineon.com/; Packing: Reel; DatasheetVersion: Rev. 2.4; PartNumber: 2N7002; PackageReference: PG-SOT23; PackageVersion: Apr-08; ComponentLink3URL: http://www.infineon.com/dgdl/SOT23-Package_Overview.pdf?folderId=db3a30431936bc4b0119532290053c66&fileId=db3a30431936bc4b0119533468123c85; ComponentLink1Description: Manufacturer URL; Mounting Technology: Surface Mount; ComponentLink3Description: Package Specification; ComponentLink2URL: http://www.infineon.com/dgdl/2N7002_Rev2.4.pdf?folderId=db3a3043156fd573011622e10b5c1f67&fileId=db3a304319bc939a0119c2a9461e79e6
R47 R49 R50 R75 = CMP-1012-00098-1: as R41 on sheet MCU_Hydro; Technology: SMT; Tolerance: 5 %; Power: 0.1 W
R48 R51 = CMP-1012-00050-1: as R43 on sheet MCU_Hydro; Tolerance: 5 %; Technology: SMT; Power: 0.1 W
S2 = EVP-AA Switch: EVP-AA Momentary Switch SPST-NO; Part Number: EVP-AA202K; Supplier 1: Digi-Key; Supplier Part Number 1: P13348SCT-ND; Datasheet: http://industrial.panasonic.com/lecs/www-data/pdf/ATK0000/ATK0000CE26.pdf
U6 = CMP-1572-00044-1: as U5 on sheet MCU_Hydro; ComponentLink2Description: Datasheet; Package Reference: LQFP100; ComponentLink1URL: http://www.st.com/; Mounting Technology: Surface Mount; DatasheetVersion: Rev. 2; Package Description: 100-Pin Low Profile Quad Flat Package, Body 14 x 14 mm, Pitch 0.5 mm; ComponentLink1Description: Manufacturer URL; ComponentLink2URL: http://www.st.com/st-web-ui/static/active/en/resource/technical/document/datasheet/DM00166116.pdf; Packing: Tray
X2 = 7M-25.000MEEQ-T: as X1 on sheet MCU_Hydro; Supplier 1: Digi-Key; Supplier Part Number 1: 887-1326-1-ND; Manufacturer Part Number 1: 7M-25.000MEEQ-T; Stock 1: 17097; Pricing 1: 1=1.27, 10=1.209, 50=1.1812, 100=1.0125, 500=0.9844, 1000=0.8297 (USD); Mount: Surface Mount; Case/Package: SMD/SMT; Number of Pins: 4; Min Operating Temperature: -20°C; Max Operating Temperature: 70°C; Load Capacitance: 10pF; Packaging: Tape and Reel; Package Quantity: 3000; Tolerance: 10ppm; Frequency Stability: 10ppm; Termination: SMD/SMT; Length: 3.2mm; Height: 0.031inch; Width: 0.098inch; Depth: 2.5mm; REACH SVHC: No SVHC; ComponentLink1URL: https://datasheet.ciiva.com/26918/getdatasheetpartid-757227-26918816.pdf; ComponentLink1Description: https://datasheet.ciiva.com/26918/getdatasheetpartid-757227-26918816.pdf; ComponentLink2URL: https://datasheet.ciiva.com/856/7m-accuracy-856022.pdf; ComponentLink2Description: https://datasheet.ciiva.com/856/7m-accuracy-856022.pdf; ComponentLink3URL: https://datasheet.ciiva.com/22658/1794111-22658486.pdf; ComponentLink3Description: https://datasheet.ciiva.com/22658/1794111-22658486.pdf; ComponentLink4URL: https://datasheet.ciiva.com/856/7m-accuracy-856023.pdf; ComponentLink4Description: https://datasheet.ciiva.com/856/7m-accuracy-856023.pdf; ComponentLink5URL: https://datasheet.ciiva.com/856/7m-accuracy-856024.pdf; ComponentLink5Description: https://datasheet.ciiva.com/856/7m-accuracy-856024.pdf; ComponentLink6URL: https://datasheet.ciiva.com/4946/7m-11184-4946126.pdf; ComponentLink6Description: https://datasheet.ciiva.com/4946/7m-11184-4946126.pdf; ComponentLink7URL: https://datasheet.ciiva.com/28498/1794111-28498878.pdf; ComponentLink7Description: https://datasheet.ciiva.com/28498/1794111-28498878.pdf

## Sheet SD.SchDoc
size A; SheetNumber: 10
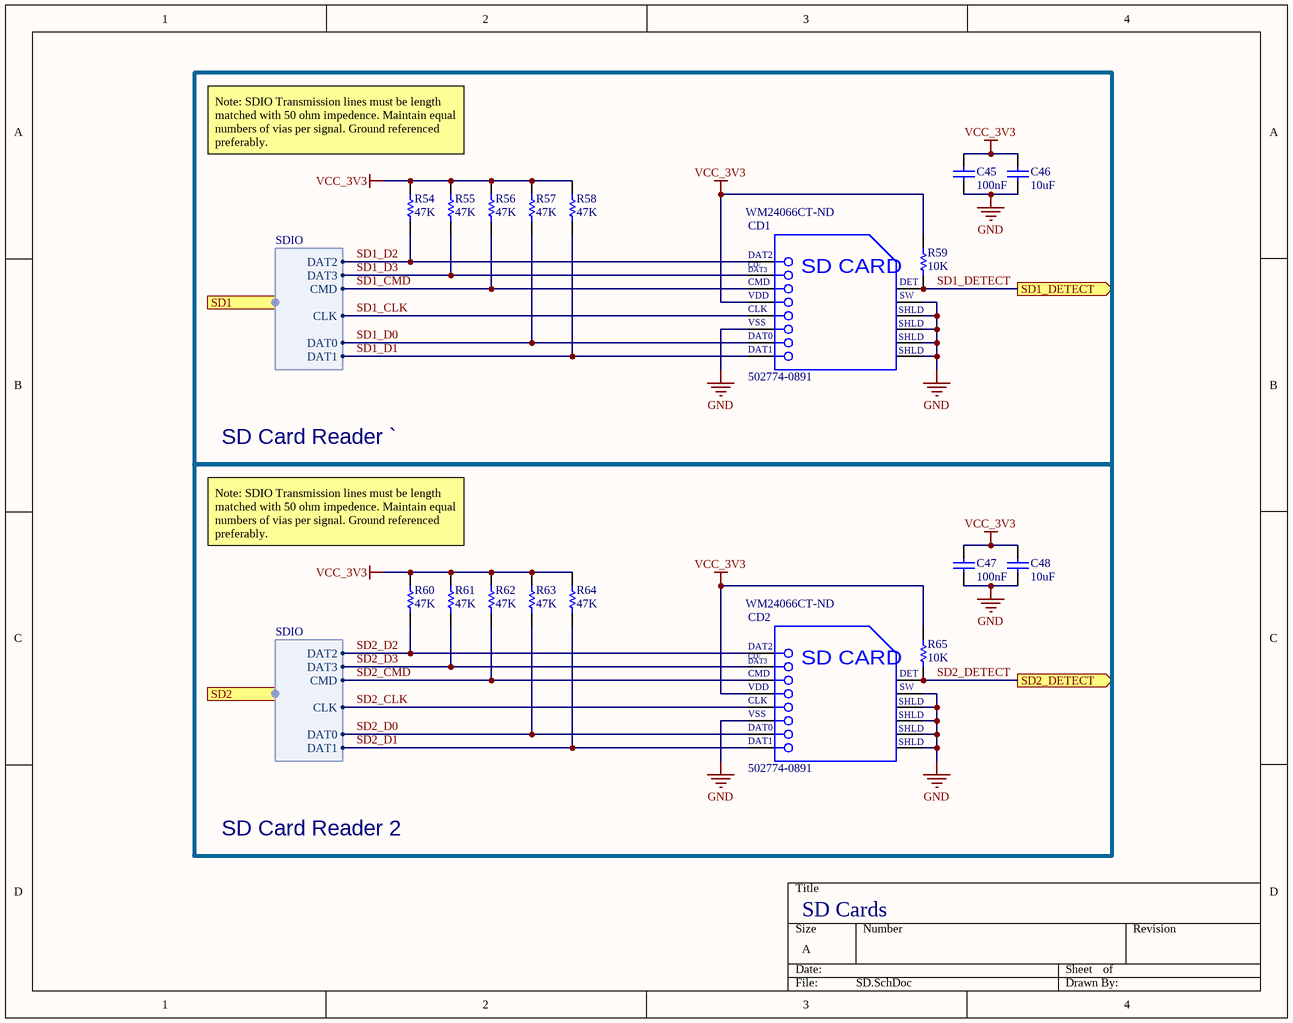
[diagram p4: SD.SchDoc]

### Parts
C45  100nF  [CAPC0603(1608)100_N]
C46  10uF  [CAPC0603(1608)100_N]
C47  100nF  [CAPC0603(1608)100_N]
C48  10uF  [CAPC0603(1608)100_N]
CD1  502774-0891  Supplier Part Number 1: WM24066CT-ND  [MOLX-502774-0891_V]
CD2  502774-0891  Supplier Part Number 1: WM24066CT-ND  [MOLX-502774-0891_V]
R54  47K  [RESC0603(1608)_N]
R55  47K  [RESC0603(1608)_N]
R56  47K  [RESC0603(1608)_N]
R57  47K  [RESC0603(1608)_N]
R58  47K  [RESC0603(1608)_N]
R59  10K  [RESC0603(1608)_N]
R60  47K  [RESC0603(1608)_N]
R61  47K  [RESC0603(1608)_N]
R62  47K  [RESC0603(1608)_N]
R63  47K  [RESC0603(1608)_N]
R64  47K  [RESC0603(1608)_N]
R65  10K  [RESC0603(1608)_N]

### Blocks framed on the sheet
SD Card Reader `: C45 C46 CD1 R54-R59
SD Card Reader 2: C47 C48 CD2 R60-R65

### Ports
SD1 (harness SDIO), SD1_DETECT (out), SD2 (harness SDIO), SD2_DETECT (out)

### Harnesses
SDIO: DAT0, DAT1, DAT2, DAT3, CMD, CLK

### Nets
GND: C45.1 C46.1 C47.1 C48.1 CD1.6(VSS) CD1.10(SWITCH) CD1.11(SHLD) CD1.12(SHLD) CD1.13(SHLD) CD1.14(SHLD) CD2.6(VSS) CD2.10(SWITCH) CD2.11(SHLD) CD2.12(SHLD) CD2.13(SHLD) CD2.14(SHLD)
VCC_3V3: C45.2 C46.2 C47.2 C48.2 CD1.4(VDD) CD2.4(VDD) R54.2 R55.2 R56.2 R57.2 R58.2 R59.2 R60.2 R61.2 R62.2 R63.2 R64.2 R65.2
SD1_CLK: CD1.5(CLK) ; port SD1.CLK  [project net MCU1_SD_CK]
SD1_CMD: CD1.3(CMD) R56.1 ; port SD1.CMD  [project net MCU1_SD_CMD]
SD1_D0: CD1.7(DAT0) R57.1 ; port SD1.DAT0  [project net MCU1_SD_D0]
SD1_D1: CD1.8(DAT1) R58.1 ; port SD1.DAT1  [project net MCU1_SD_D1]
SD1_D2: CD1.1(DAT2) R54.1 ; port SD1.DAT2  [project net MCU1_SD_D2]
SD1_D3: CD1.2(CD/DAT3) R55.1 ; port SD1.DAT3  [project net MCU1_SD_D3]
SD1_DETECT: CD1.9(DETECT) R59.1 ; port SD1_DETECT  [project net MCU1_SD_DETECT]
SD2_CLK: CD2.5(CLK) ; port SD2.CLK  [project net MCU2_SD_CK]
SD2_CMD: CD2.3(CMD) R62.1 ; port SD2.CMD  [project net MCU2_SD_CMD]
SD2_D0: CD2.7(DAT0) R63.1 ; port SD2.DAT0  [project net MCU2_SD_D0]
SD2_D1: CD2.8(DAT1) R64.1 ; port SD2.DAT1  [project net MCU2_SD_D1]
SD2_D2: CD2.1(DAT2) R60.1 ; port SD2.DAT2  [project net MCU2_SD_D2]
SD2_D3: CD2.2(CD/DAT3) R61.1 ; port SD2.DAT3  [project net MCU2_SD_D3]
SD2_DETECT: CD2.9(DETECT) R65.1 ; port SD2_DETECT  [project net MCU2_SD_DETECT]

### Notes on the sheet
- Note: SDIO Transmission lines must be length matched with 50 ohm impedence. Maintain equal numbers of vias per signal. Ground referenced preferably.
- SD Cards
- (in symbol CMP-2000-05248-1) CD/; DAT3; SD CARD; DET; SW

### Library data of the parts
C45 C47 = CMP-1035-02580-1: as C2#1 on sheet Hydrophones; Max Thickness: 1 mm; Value: 100nF; Rated Voltage: 10 V; Technology: SMT
C46 C48 = CMP-1035-02799-1: CAP 10uF 10V ±10% 0603 (1608 Metric) Thickness 1mm SMD; Tolerance: Â±10%; Case-Metric: 1608; Case-EIA: 0603; Max Thickness: 1 mm; Technology: SMT; Rated Voltage: 10 V; Value: 10uF
CD1 CD2 = CMP-2000-05248-1: Micro SD Memory Card Connector, 0.5 A, 10 V (DC), -25 to 85 degC, 8-Pin SMT, RoHS, Tape and Reel; Manufacturer: Molex; 3D Model: 502774-0891.stp; Online Catalog: microSD™Series; Number of Positions: 10(8+2); Card Type: SecureDigital-microSD™; Insertion, Removal Method: PushIn,PushOut; Other Names: WM24066DKR; Connector Type: ConnectorandEjector; Gender: Male; Max Voltage Rating (DC): 1.01kV; Current Rating: 500mA; Voltage Rating (AC): 10V; Number of Contacts: 8; Pitch: 1.1mm; Features: Switch; Family: MemoryConnectors-PCCardSockets; Manufacturer URL: http://www.molex.com/; Mounting Type: SurfaceMount,RightAngle; Contact Finish Thickness: 20µin(0.51µm); Standard Package: 1; Series: 502774; Ejector Side: -; Datasheet Version: Rev. D, 04/2004; Category: Connectors,Interconnects; Contact Finish: Gold; Datasheet URL: https://datasheet.ciiva.com/1104/1499551-1104671.pdf; RoHS Information: 502774-0891CertofCompliance; Mounting Feature: Reverse-Bottom; Packaging: Digi-Reel; Height Above Board: 0.071"(1.80mm); Catalog Drawings: 502774-0891; Supplier 1: Digi-Key; Manufacturer Part Number: 502774-0891; Stock 1: 7772; Pricing 1: 1=3.31, 10=3.177, 25=2.912, 50=2.7796, 100=2.6473, 250=2.3164, 500=2.2502 (USD); Mount: Surface Mount,Reverse; Contact Material: Copper,Copper Alloy; Contact Plating: Gold; Housing Material: Polymer; Min Operating Temperature: -25°C; Max Operating Temperature: 85°C; Number of Rows: 1; Package Quantity: 1; Termination: Solder; Orientation: Right Angle; Number of Circuits: 8; Length: 14.6mm; Height: 1.8mm; Width: 1.8mm; Depth: 16mm; Radiation Hardening: No; REACH SVHC: Unknown; Halogen Free: Low Halogen; ComponentLink1URL: https://datasheet.ciiva.com/15226/getdatasheetpartid-119109-15226226.pdf; ComponentLink1Description: https://datasheet.ciiva.com/15226/getdatasheetpartid-119109-15226226.pdf; ComponentLink2URL: https://datasheet.ciiva.com/16655/5027740891-memory-card-socket-16655603.pdf; ComponentLink2Description: https://datasheet.ciiva.com/16655/5027740891-memory-card-socket-16655603.pdf; ComponentLink3URL: https://datasheet.ciiva.com/11755/0900766b80f752a0-11755064.pdf; ComponentLink3Description: https://datasheet.ciiva.com/11755/0900766b80f752a0-11755064.pdf; ComponentLink4URL: https://datasheet.ciiva.com/683/5027740891-sd-683628.pdf; ComponentLink4Description: https://datasheet.ciiva.com/683/5027740891-sd-683628.pdf; ComponentLink5URL: https://datasheet.ciiva.com/683/5027740891-sd-683629.pdf; ComponentLink5Description: https://datasheet.ciiva.com/683/5027740891-sd-683629.pdf; ComponentLink6URL: https://datasheet.ciiva.com/683/5027740891-sd-683630.pdf; ComponentLink6Description: https://datasheet.ciiva.com/683/5027740891-sd-683630.pdf; ComponentLink7URL: https://datasheet.ciiva.com/1104/ps-502774-001-1104670.pdf; ComponentLink7Description: https://datasheet.ciiva.com/1104/ps-502774-001-1104670.pdf; ComponentLink8URL: https://datasheet.ciiva.com/4581/5027740891-memory-card-socket-179575-4581102.pdf; ComponentLink8Description: https://datasheet.ciiva.com/4581/5027740891-memory-card-socket-179575-4581102.pdf; ComponentLink9URL: https://datasheet.ciiva.com/1104/1499551-1104671.pdf; ComponentLink9Description: https://datasheet.ciiva.com/1104/1499551-1104671.pdf
R54-R58 R60-R64 = CMP-1012-00699-1: 47K 0.1W 1% 0603 (1608 Metric)  SMD; Case-Metric: 1608; Case-EIA: 0603; Value: 47000.00 Ohm; Technology: SMT; Power: 0.1 W; Tolerance: 1 %
R59 R65 = CMP-1012-00098-1: as R41 on sheet MCU_Hydro; Technology: SMT; Tolerance: 5 %; Power: 0.1 W

## Sheet USB.SchDoc
size A; SheetNumber: 11
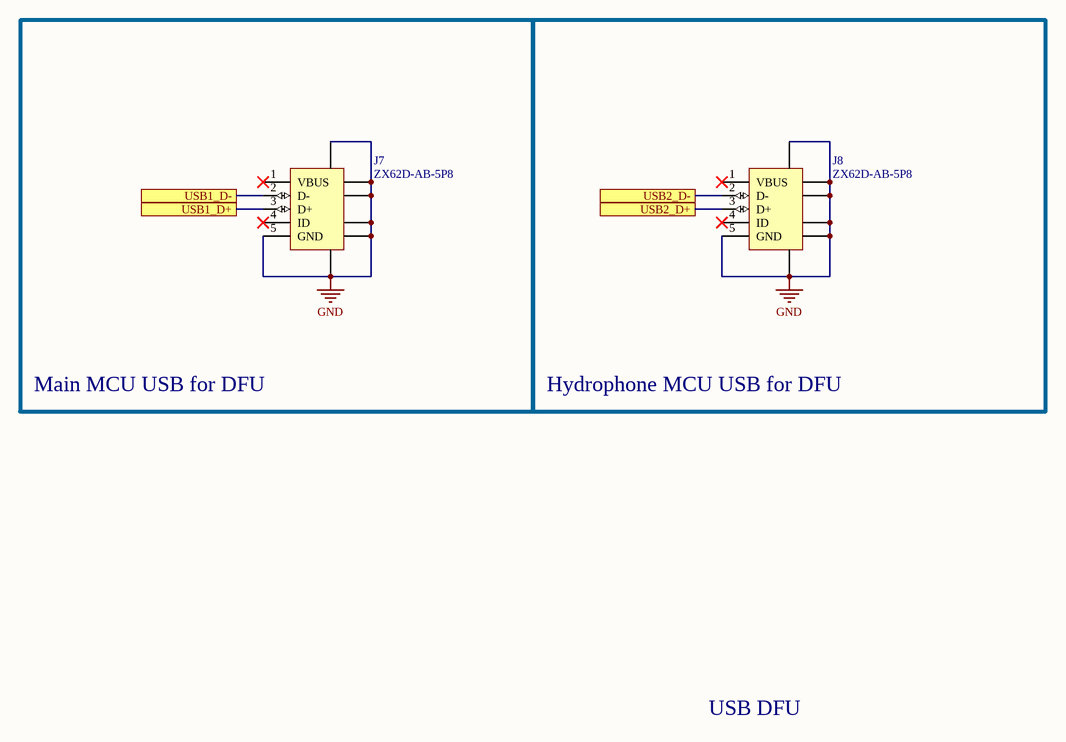
[diagram p5: USB.SchDoc]

### Parts
J7  ZX62D-AB-5P8  [HIRO-ZX62D-AB-5P8_V]
J8  ZX62D-AB-5P8  [HIRO-ZX62D-AB-5P8_V]

### Blocks framed on the sheet
Main MCU USB for DFU: J7
Hydrophone MCU USB for DFU: J8

### Ports
USB1_D+, USB1_D-, USB2_D+, USB2_D-

### Nets
GND: J7.5(GND) J7.6(SHLD) J7.7(SHLD) J7.8(SHLD) J7.9(SHLD) J7.10(SHLD) J7.11(SHLD) J8.5(GND) J8.6(SHLD) J8.7(SHLD) J8.8(SHLD) J8.9(SHLD) J8.10(SHLD) J8.11(SHLD)
MCU1_USB_DM: J7.2(D-) ; port USB1_D-
MCU1_USB_DP: J7.3(D+) ; port USB1_D+
MCU2_USB_DM: J8.2(D-) ; port USB2_D-
MCU2_USB_DP: J8.3(D+) ; port USB2_D+

Not connected (* = marked no-connect by the designer): J7 1(VBUS)* 4(ID)*; J8 1(VBUS)* 4(ID)*

### Notes on the sheet
- USB DFU

### Library data of the parts
J7 J8 = CMP-1349-00001-2: USB 2.0 Standard Micro-USB Connector, Micro AB-Standard (Bottom Mount), 30 V AC, -30 to 85 degC, Right Angle, 5-Pin 7.5 x 5.6 x 2.8 mm SMD, RoHS, Reel; Manufacturer: Hirose Electric; Number of Contacts: 5; Capacitance: 2 pF Max.; Voltage Rating: 30 V AC; Contact Resistance: 30 mOhm Max.; PartNumber: ZX62D-AB-5P8; Mounting Technology: Surface Mount; ComponentLink1URL: http://www.hirose.com/; ComponentLink2URL: http://www.hirose.co.jp/cataloge_hp/ed_ZX_20140804.pdf; ComponentLink1Description: Manufacturer URL; ComponentLink3Description: Package Specification; Operating Temperature Range: -30 to 85 degC; RoHS: TRUE; DatasheetVersion: Aug-14; PackageDescription: USB Micro-AB Connector, Right Angle, Body 7.5 x 5.6 mm, Pitch 0.65 mm, Height 2.8 mm; ComponentLink3URL: http://www.hirose.co.jp/cataloge_hp/ed_ZX_20140804.pdf; Packing: Reel; ComponentLink2Description: Datasheet

## Sheet MCU_Powers.SchDoc
size A; SheetNumber: 4
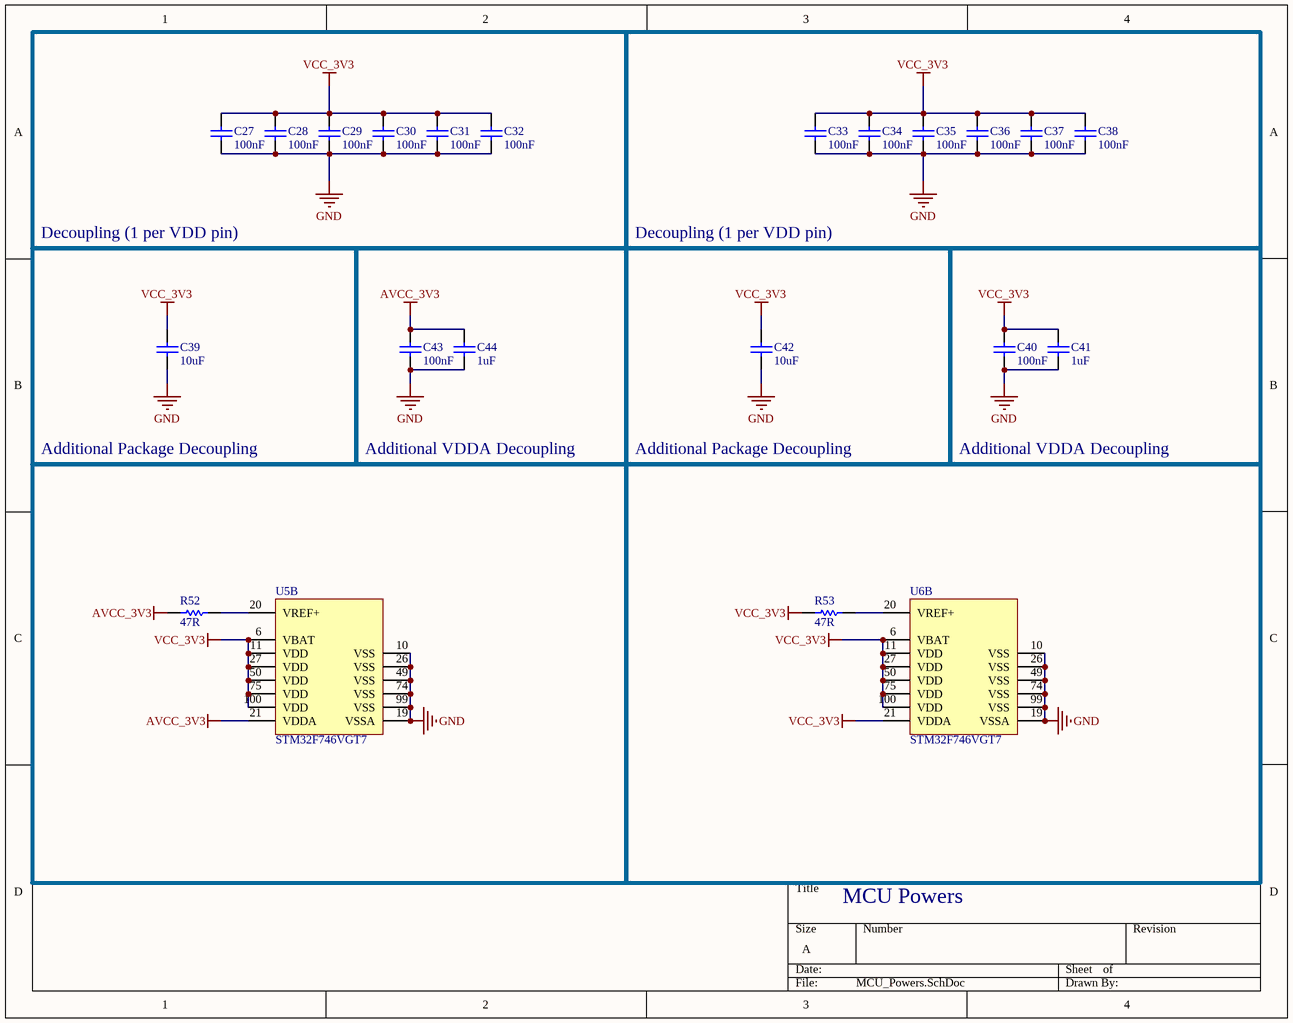
[diagram p6: MCU_Powers.SchDoc]

### Parts
C27  100nF  [CAPC0603(1608)100_N]
C28  100nF  [CAPC0603(1608)100_N]
C29  100nF  [CAPC0603(1608)100_N]
C30  100nF  [CAPC0603(1608)100_N]
C31  100nF  [CAPC0603(1608)100_N]
C32  100nF  [CAPC0603(1608)100_N]
C33  100nF  [CAPC0603(1608)100_N]
C34  100nF  [CAPC0603(1608)100_N]
C35  100nF  [CAPC0603(1608)100_N]
C36  100nF  [CAPC0603(1608)100_N]
C37  100nF  [CAPC0603(1608)100_N]
C38  100nF  [CAPC0603(1608)100_N]
C39  10uF  [CAPC0603(1608)100_N]
C40  100nF  [CAPC0603(1608)100_N]
C41  1uF  [CAPC0603(1608)100_N]
C42  10uF  [CAPC0603(1608)100_N]
C43  100nF  [CAPC0603(1608)100_N]
C44  1uF  [CAPC0603(1608)100_N]
R52  47R  [RESC0603(1608)_N]
R53  47R  [RESC0603(1608)_N]
U5  STM32F746VGT7  [STM-LQFP100_L]  (part B of 2)
U6  STM32F746VGT7  [STM-LQFP100_L]  (part B of 2)

### Blocks framed on the sheet
Decoupling (1 per VDD pin): C27-C32
Decoupling (1 per VDD pin): C33-C38
Additional VDDA Decoupling: C43 C44
Additional VDDA Decoupling: C40 C41
Additional Package Decoupling: R52 U5
Additional Package Decoupling: R53 U6

### Nets
AVCC_3V3: C43.2 C44.2 R52.1 U5.21(VDDA)
GND: C27.1 C28.1 C29.1 C30.1 C31.1 C32.1 C33.1 C34.1 C35.1 C36.1 C37.1 C38.1 C39.1 C40.1 C41.1 C42.1 C43.1 C44.1 U5.10(VSS) U5.19(VSSA) U5.26(VSS) U5.49(VSS) U5.74(VSS) U5.99(VSS) U6.10(VSS) U6.19(VSSA) U6.26(VSS) U6.49(VSS) U6.74(VSS) U6.99(VSS)
VCC_3V3: C27.2 C28.2 C29.2 C30.2 C31.2 C32.2 C33.2 C34.2 C35.2 C36.2 C37.2 C38.2 C39.2 C40.2 C41.2 C42.2 R53.1 U5.6(VBAT) U5.11(VDD) U5.27(VDD) U5.50(VDD) U5.75(VDD) U5.100(VDD) U6.6(VBAT) U6.11(VDD) U6.21(VDDA) U6.27(VDD) U6.50(VDD) U6.75(VDD) U6.100(VDD)
NetR52_2: R52.2 U5.20(VREF+)
NetR53_2: R53.2 U6.20(VREF+)

### Notes on the sheet
- MCU Powers

### Library data of the parts
C27-C38 C40 C43 = CMP-1035-02580-1: as C2#1 on sheet Hydrophones; Max Thickness: 1 mm; Value: 100nF; Rated Voltage: 10 V; Technology: SMT
C39 C42 = CMP-1035-02799-1: as C46 on sheet SD; Max Thickness: 1 mm; Technology: SMT; Rated Voltage: 10 V; Value: 10uF
C41 C44 = CMP-1035-02733-1: as C1#1 on sheet Hydrophones; Rated Voltage: 10 V; Max Thickness: 1 mm; Value: 1uF; Technology: SMT
R52 R53 = CMP-1012-00360-1: 47R 0.1W 1% 0603 (1608 Metric)  SMD; Case-EIA: 0603; Case-Metric: 1608; Value: 47.00 Ohm; Power: 0.1 W; Technology: SMT; Tolerance: 1 %
U5 U6 = CMP-1572-00044-1: as U5 on sheet MCU_Hydro; ComponentLink2Description: Datasheet; Package Reference: LQFP100; ComponentLink1URL: http://www.st.com/; Mounting Technology: Surface Mount; DatasheetVersion: Rev. 2; Package Description: 100-Pin Low Profile Quad Flat Package, Body 14 x 14 mm, Pitch 0.5 mm; ComponentLink1Description: Manufacturer URL; ComponentLink2URL: http://www.st.com/st-web-ui/static/active/en/resource/technical/document/datasheet/DM00166116.pdf; Packing: Tray

## Sheet Power.SchDoc
size A; SheetNumber: 3
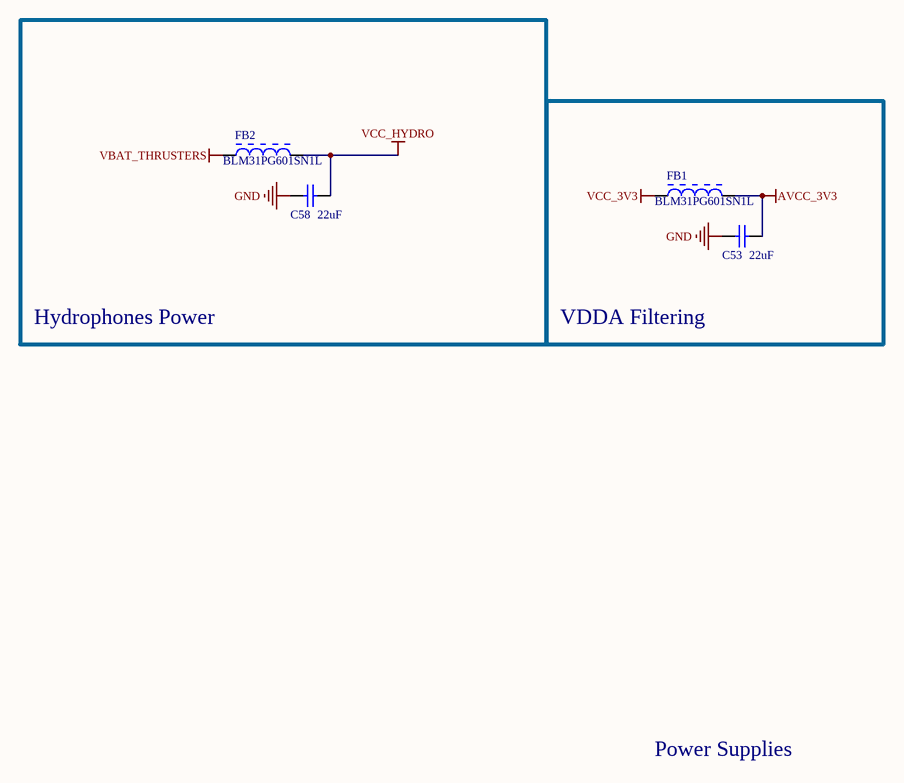
[diagram p7: Power.SchDoc]

### Parts
C53  22uF  [CAPC1210(3225)100_N]
C58  22uF  [CAPC1210(3225)100_N]
FB1  BLM31PG601SN1L  [MURA-BLM31-B-CHIP-2_V]
FB2  BLM31PG601SN1L  [MURA-BLM31-B-CHIP-2_V]

### Blocks framed on the sheet
Hydrophones Power: C58 FB2
VDDA Filtering: C53 FB1

### Nets
AVCC_3V3: C53.1 FB1.2
GND: C53.2 C58.2
VBAT_THRUSTERS: FB2.1
VCC_3V3: FB1.1
VCC_HYDRO: C58.1 FB2.2

### Notes on the sheet
- Power Supplies

### Library data of the parts
C53 C58 = CMP-1038-01290-1: CAP 22nF 16V ±5% 1210 (3225 Metric) Thickness 1mm SMD; Case-EIA: 1210; Tolerance: ±20%; Case-Metric: 3225; Value: 22uF; Max Thickness: 1 mm; Technology: SMT; Rated Voltage: 16 V
FB1 FB2 = CMP-0686-00744-2: Chip Ferrite Bead for Power Lines, 600 Ohm, 1500 mA, -55 to 125 degC, 3.2 x 1.6 x 1.3 mm SMD, Tape and Reel; Manufacturer: Murata; DC Resistance: 0.08 Ohm Max.; Impedance (at 100 MHz): 600 Ohm +/- 25%; Rated Current: 1500 mA; ComponentLink1URL: http://www.murata.com/; ComponentLink3Description: Package Specification; DatasheetVersion: 08/2013; PartNumber: BLM31PG601SN1L; Mounting Technology: Surface Mount; ComponentLink3URL: http://www.murata.com/products/catalog/pdf/c31e.pdf; ComponentLink2Description: Datasheet; PackageDescription: 2-Pin Chip, Body 3.2 x 1.6 mm; Operating Temperature Range: -55 to 125 degC; ComponentLink1Description: Manufacturer URL; ComponentLink2URL: http://www.murata.com/products/catalog/pdf/c31e.pdf; PackageReference: BLM31-2; Packing: Tape and Reel

## Sheet Servos.SchDoc
size A; SheetNumber: 8
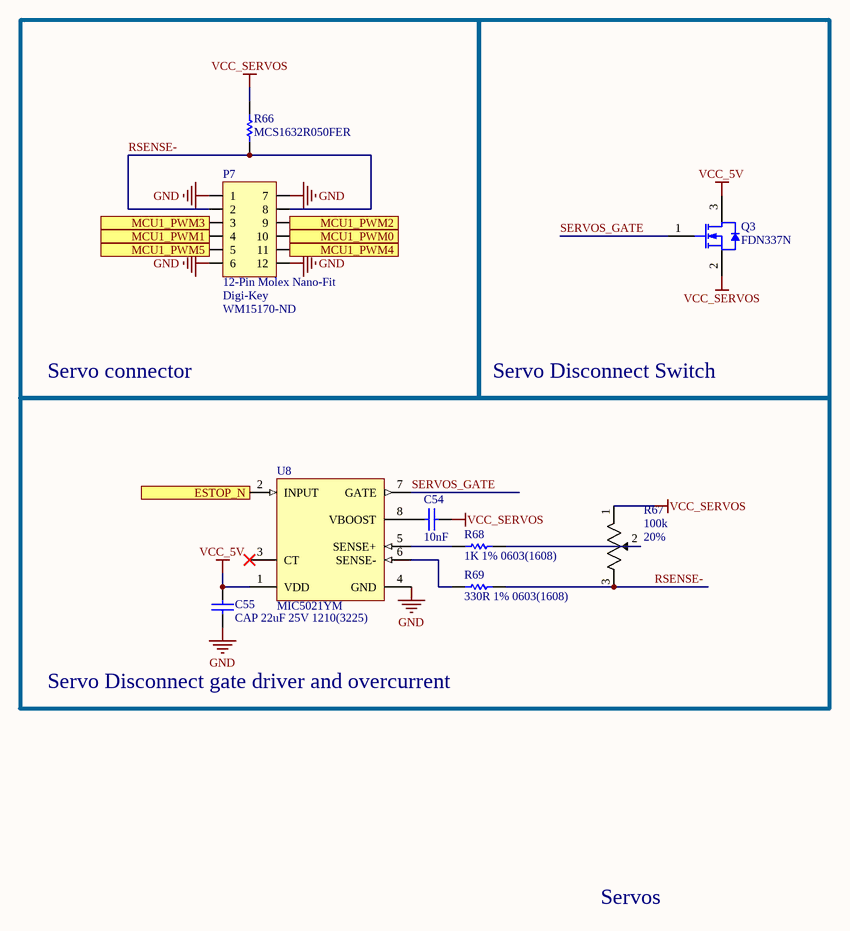
[diagram p8: Servos.SchDoc]

### Parts
C54  10nF  [CAPC0603(1608)100_N]
C55  CAP 22uF 25V 1210(3225)  [CAPC1210(3225)220_N]
P7  12-Pin Molex Nano-Fit  Supplier 1: Digi-Key  Supplier Part Number 1: WM15170-ND  [MOLEX NANO-FIT 2X6 - Right Angle]
Q3  FDN337N  [FAIR-SSOT3L-3_V]
R66  MCS1632R050FER  [RESC3216X62X50LL20T20]
R67  value 100k  Tolerance: 20%  [TT BI 22A TRIM POT]  (hidden comment: 22AR100KLFTR)
R68  1K 1% 0603(1608)  [RESC0603(1608)_N]
R69  330R 1% 0603(1608)  [RESC0603(1608)_N]
U8  MIC5021YM  [MICL-SOICN-8LD-PL-1_V]

### Blocks framed on the sheet
Servo connector: P7 R66
Servo Disconnect Switch: Q3
Servo Disconnect gate driver and overcurrent: C54 C55 R67-R69 U8

### Ports
ESTOP_N, MCU1_PWM0 (in), MCU1_PWM1 (in), MCU1_PWM2 (in), MCU1_PWM3 (in), MCU1_PWM4 (in), MCU1_PWM5 (in)

### Nets
GND: C55.1 P7.1 P7.6 P7.7 P7.12 U8.4(GND)
VCC_5V: C55.2 Q3.3(D) U8.1(VDD)
VCC_SERVOS: C54.2 Q3.2(S) R66.2 R67.1
HALL_SENSE: U8.2(INPUT) ; port ESTOP_N
MCU1_PWM0: P7.10 ; port MCU1_PWM0
MCU1_PWM1: P7.4 ; port MCU1_PWM1
MCU1_PWM2: P7.9 ; port MCU1_PWM2
MCU1_PWM3: P7.3 ; port MCU1_PWM3
MCU1_PWM4: P7.11 ; port MCU1_PWM4
MCU1_PWM5: P7.5 ; port MCU1_PWM5
RSENSE-: P7.2 P7.8 R66.1 R67.3 R69.2
SERVOS_GATE: Q3.1(G) U8.7(GATE)
NetC54_1: C54.1 U8.8(VBOOST)
NetR67_2: R67.2 R68.2
NetR68_1: R68.1 U8.5(SENSE+)
NetR69_1: R69.1 U8.6(SENSE-)

Not connected (* = marked no-connect by the designer): U8 3(CT)*

### Notes on the sheet
- Servos

### Library data of the parts
C54 = CMP-1035-02315-1: CAP 10nF 25V ±2% 0603 (1608 Metric) Thickness 1mm SMD; Tolerance: Â±2%; Case-Metric: 1608; Case-EIA: 0603; Rated Voltage: 25 V; Technology: SMT; Max Thickness: 1 mm; Value: 10nF
C55 = CMP-1038-02286-1: CAP 22uF 25V -20% to +80% 1210 (3225 Metric) Thickness 2.2mm SMD; Case-Metric: 3225; Case-EIA: 1210; Rated Voltage: 25 V; Technology: SMT; Max Thickness: 2.2 mm; Value: 22uF; Tolerance: -20% to +80%
P7 = 12-Pin 2-Row Nano-Fit: NanoFit RA Hdr TH DR 12Ckt; ComponentLink1Description: Digikey Link; ComponentLink1URL: https://www.digikey.com/product-detail/en/molex-llc/1053141312/WM15170-ND/6164259
Q3 = CMP-2000-06250-1: N-Channel Logic Level Enhancement Mode Field Effect Transistor,2.2 A, 30 V, -55 to 150 degC, 3-Pin SOT-23, RoHS, Tape and Reel; Manufacturer: Fairchild Semiconductor; Transistor Polarity: NChannel; RDS(on): 0.082Ohm; External Depth: 2.5mm; Reel Quantity: 3000; Threshold Voltage Vgs Typ: 700mV; Current Id Max: 2.2A; External Length / Height: 1.12mm; No. of Pins: 3; Vgss: +/-8V; Voltage Vgs Rds on Measurement: 4.5V; Power Dissipation Pd: 500mW; Full Power Rating Temperature: 25°C; Pulse Current Idm: 10A; Vdss: 30V; Continuous Drain Current Id: 2.5A; SMD Marking: 337; No. of Transistors: 1; SVHC: NoSVHC(19-Dec-2012); Package Version: Rev. 3, 05/2015; Vth: 0.7V; Drain Source Voltage Vds: 20V; On Resistance Rds(on): 52mohm; Trr: 10ns; External Width: 3.05mm; Operating Temperature Range: -55°Cto+150°C; Operating Temperature Min: -55°C; Package / Case: SOT-23; Operating Temperature Max: 150°C; Manufacturer URL: https://www.fairchildsemi.com/; Id: 2.2A; Mounting Technology: SurfaceMount; Rds(on) Test Voltage Vgs: 4.5V; Voltage Vds Typ: 30V; Datasheet Version: Rev. C, 03/1998; Transistor Case Style: SOT-23; Termination Type: SMD; Package Reference: SSOT3L; Package Description: 3-Pin Small Outline Transistor, Body 2.92 x 1.4 mm, Pitch 0.95 mm; Voltage Vgs Max: 700mV; Tape Width: 8mm; Datasheet URL: https://www.fairchildsemi.com/datasheets/FD/FDN337N.pdf; Package URL: https://www.fairchildsemi.com/package-drawings/MA/MA03B.pdf; Current Temperature: 25°C
R66 = CMP-1678-00004-1: Chip Resistor, 0.05 Ohm, +/- 1%, 1 W, -55 to 155 degC, 1206 (3216 Metric), RoHS, Tape and Reel; Frequency: 12 MHz; Resistance: 60 Ohm; Frequency Tolerance: 30ppm; Load Capacitance: 20 pF; Tolerance: 50ppm; Capacitance: 2E-11 f; Length: 11.35 mm; ComponentLink2URL: http://www.ohmite.com/cat/res_mcs.pdf; Mount: Through Hole; ComponentLink2Description: Datasheet; Radiation Hardening: No; ESR: 60 Ohm; ComponentLink1URL: http://www.ohmite.com/; PackageReference: 1206; Package Quantity: 100; DatasheetVersion: Nov-16; REACH SVHC: No SVHC; Width: 4.65 mm; Max Operating Temperature: 70 degC; ComponentLink1Description: Manufacturer URL; Min Operating Temperature: -20 degC; RoHSCompliant: true; Packaging: Bulk; PackageDescription: 2-Pin Surface Mount Device, Body 3.2 x 1.6 mm; Pins: 2; Height: 3.6 mm
R67 = TT 22AR Trim Pot: TT Electronics BI 22AR100KLFTR SMT trim pot, 100k 20%; Supplier 1: Digi-Key; Supplier Part Number 1: 987-1003-1-ND; Datasheet: http://www.bitechnologies.com/pdfs/22.pdf
R68 = CMP-1012-00510-1: 1K 0.1W 1% 0603 (1608 Metric)  SMD; Case-Metric: 1608; Case-EIA: 0603; Value: 1000.00 Ohm; Technology: SMT; Tolerance: 1 %; Power: 0.1 W
R69 = CMP-1012-00454-1: 330R 0.1W 1% 0603 (1608 Metric)  SMD; Case-Metric: 1608; Value: 330.00 Ohm; Case-EIA: 0603; Tolerance: 1 %; Technology: SMT; Power: 0.1 W
U8 = CMP-1558-00003-1: High-Speed High-Side MOSFET Driver, 12 to 36 V, -40 to 85 degC, 8-Pin SOIC, RoHS, Tube; VDD Min: 12 V; VDD Max: 36 V; ComponentLink2Description: Datasheet; Temperature Max: 85 degC; PackageDescription: 8-Pin Small Outline Integrated Package, Body 4.89 x 3.90 mm, Pitch 1.27 mm; ComponentLink1Description: Manufacturer URL; RoHS: TRUE; Temperature Min: -40 degC; ComponentLink2URL: http://www.micrel.com/_PDF/mic5021.pdf; PackageVersion: Rev. A; ComponentLink3Description: Package Specification; PartNumber: MIC5021YM; ComponentLink3URL: http://www.micrel.com/_Packages/SOICN-8LD-PL-1.pdf; Packing: Tube; Mounting Technology: Surface Mount; ComponentLink1URL: http://www.micrel.com/